# EAGLE schematic AES_HWR1_M2018 (EAGLE 8.6.1)
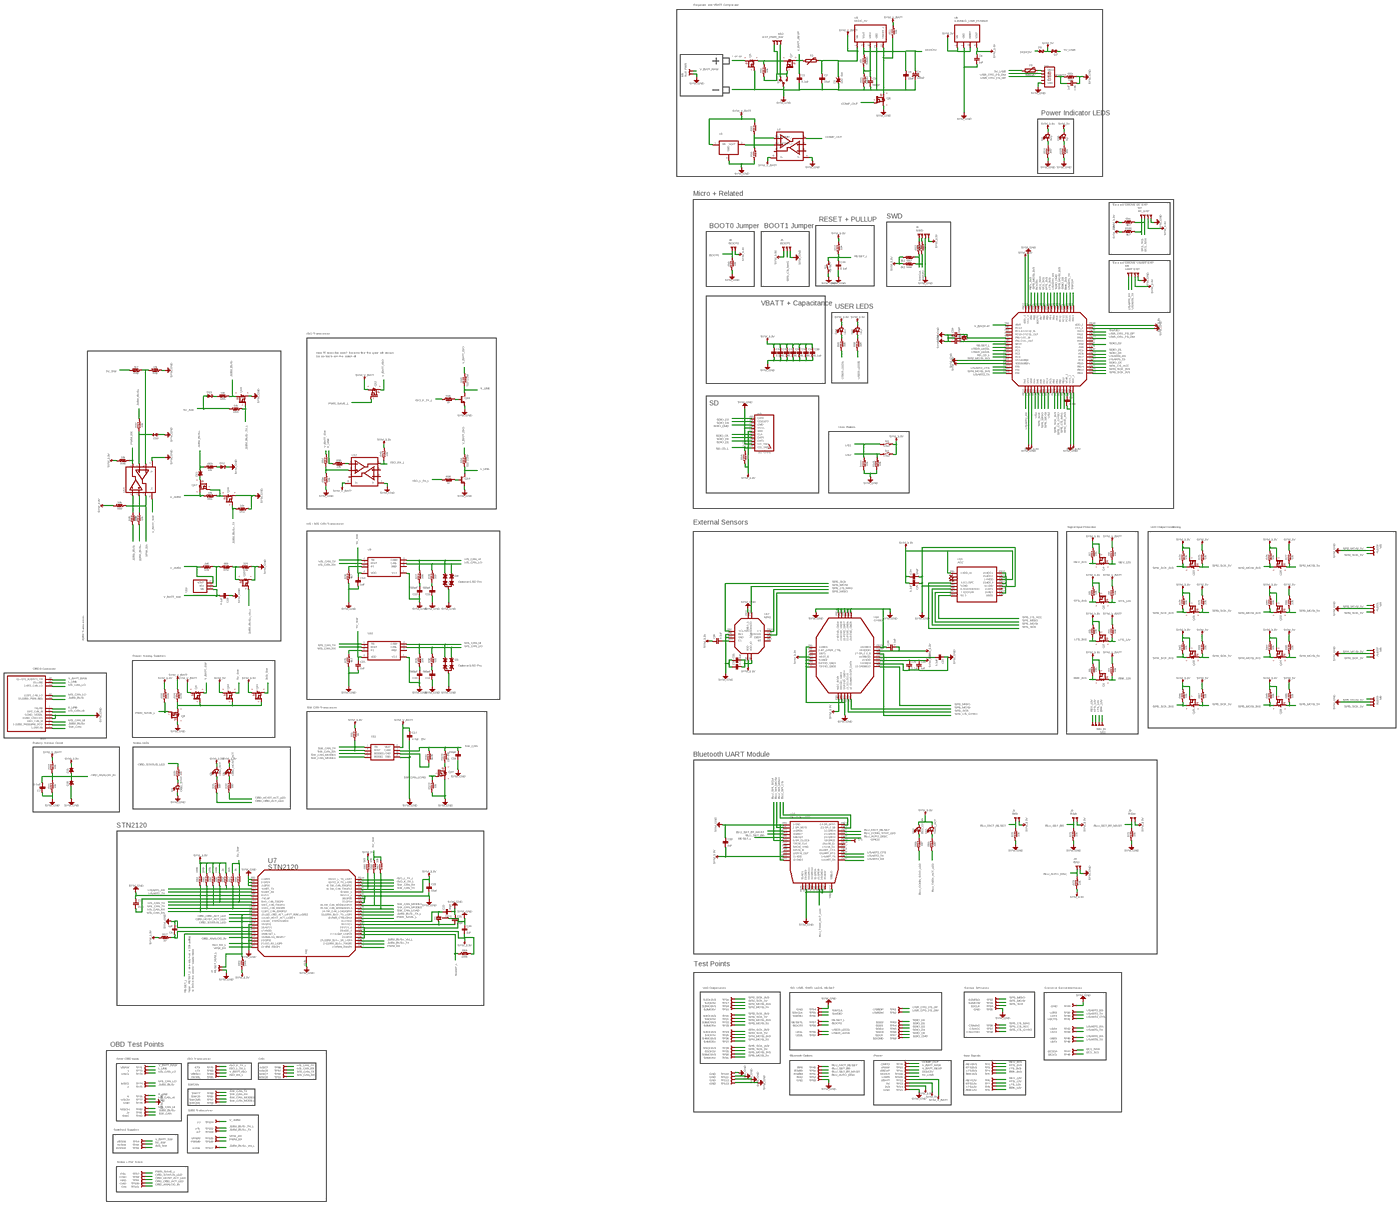
[diagram p0: schematic, sheet 1, overview]
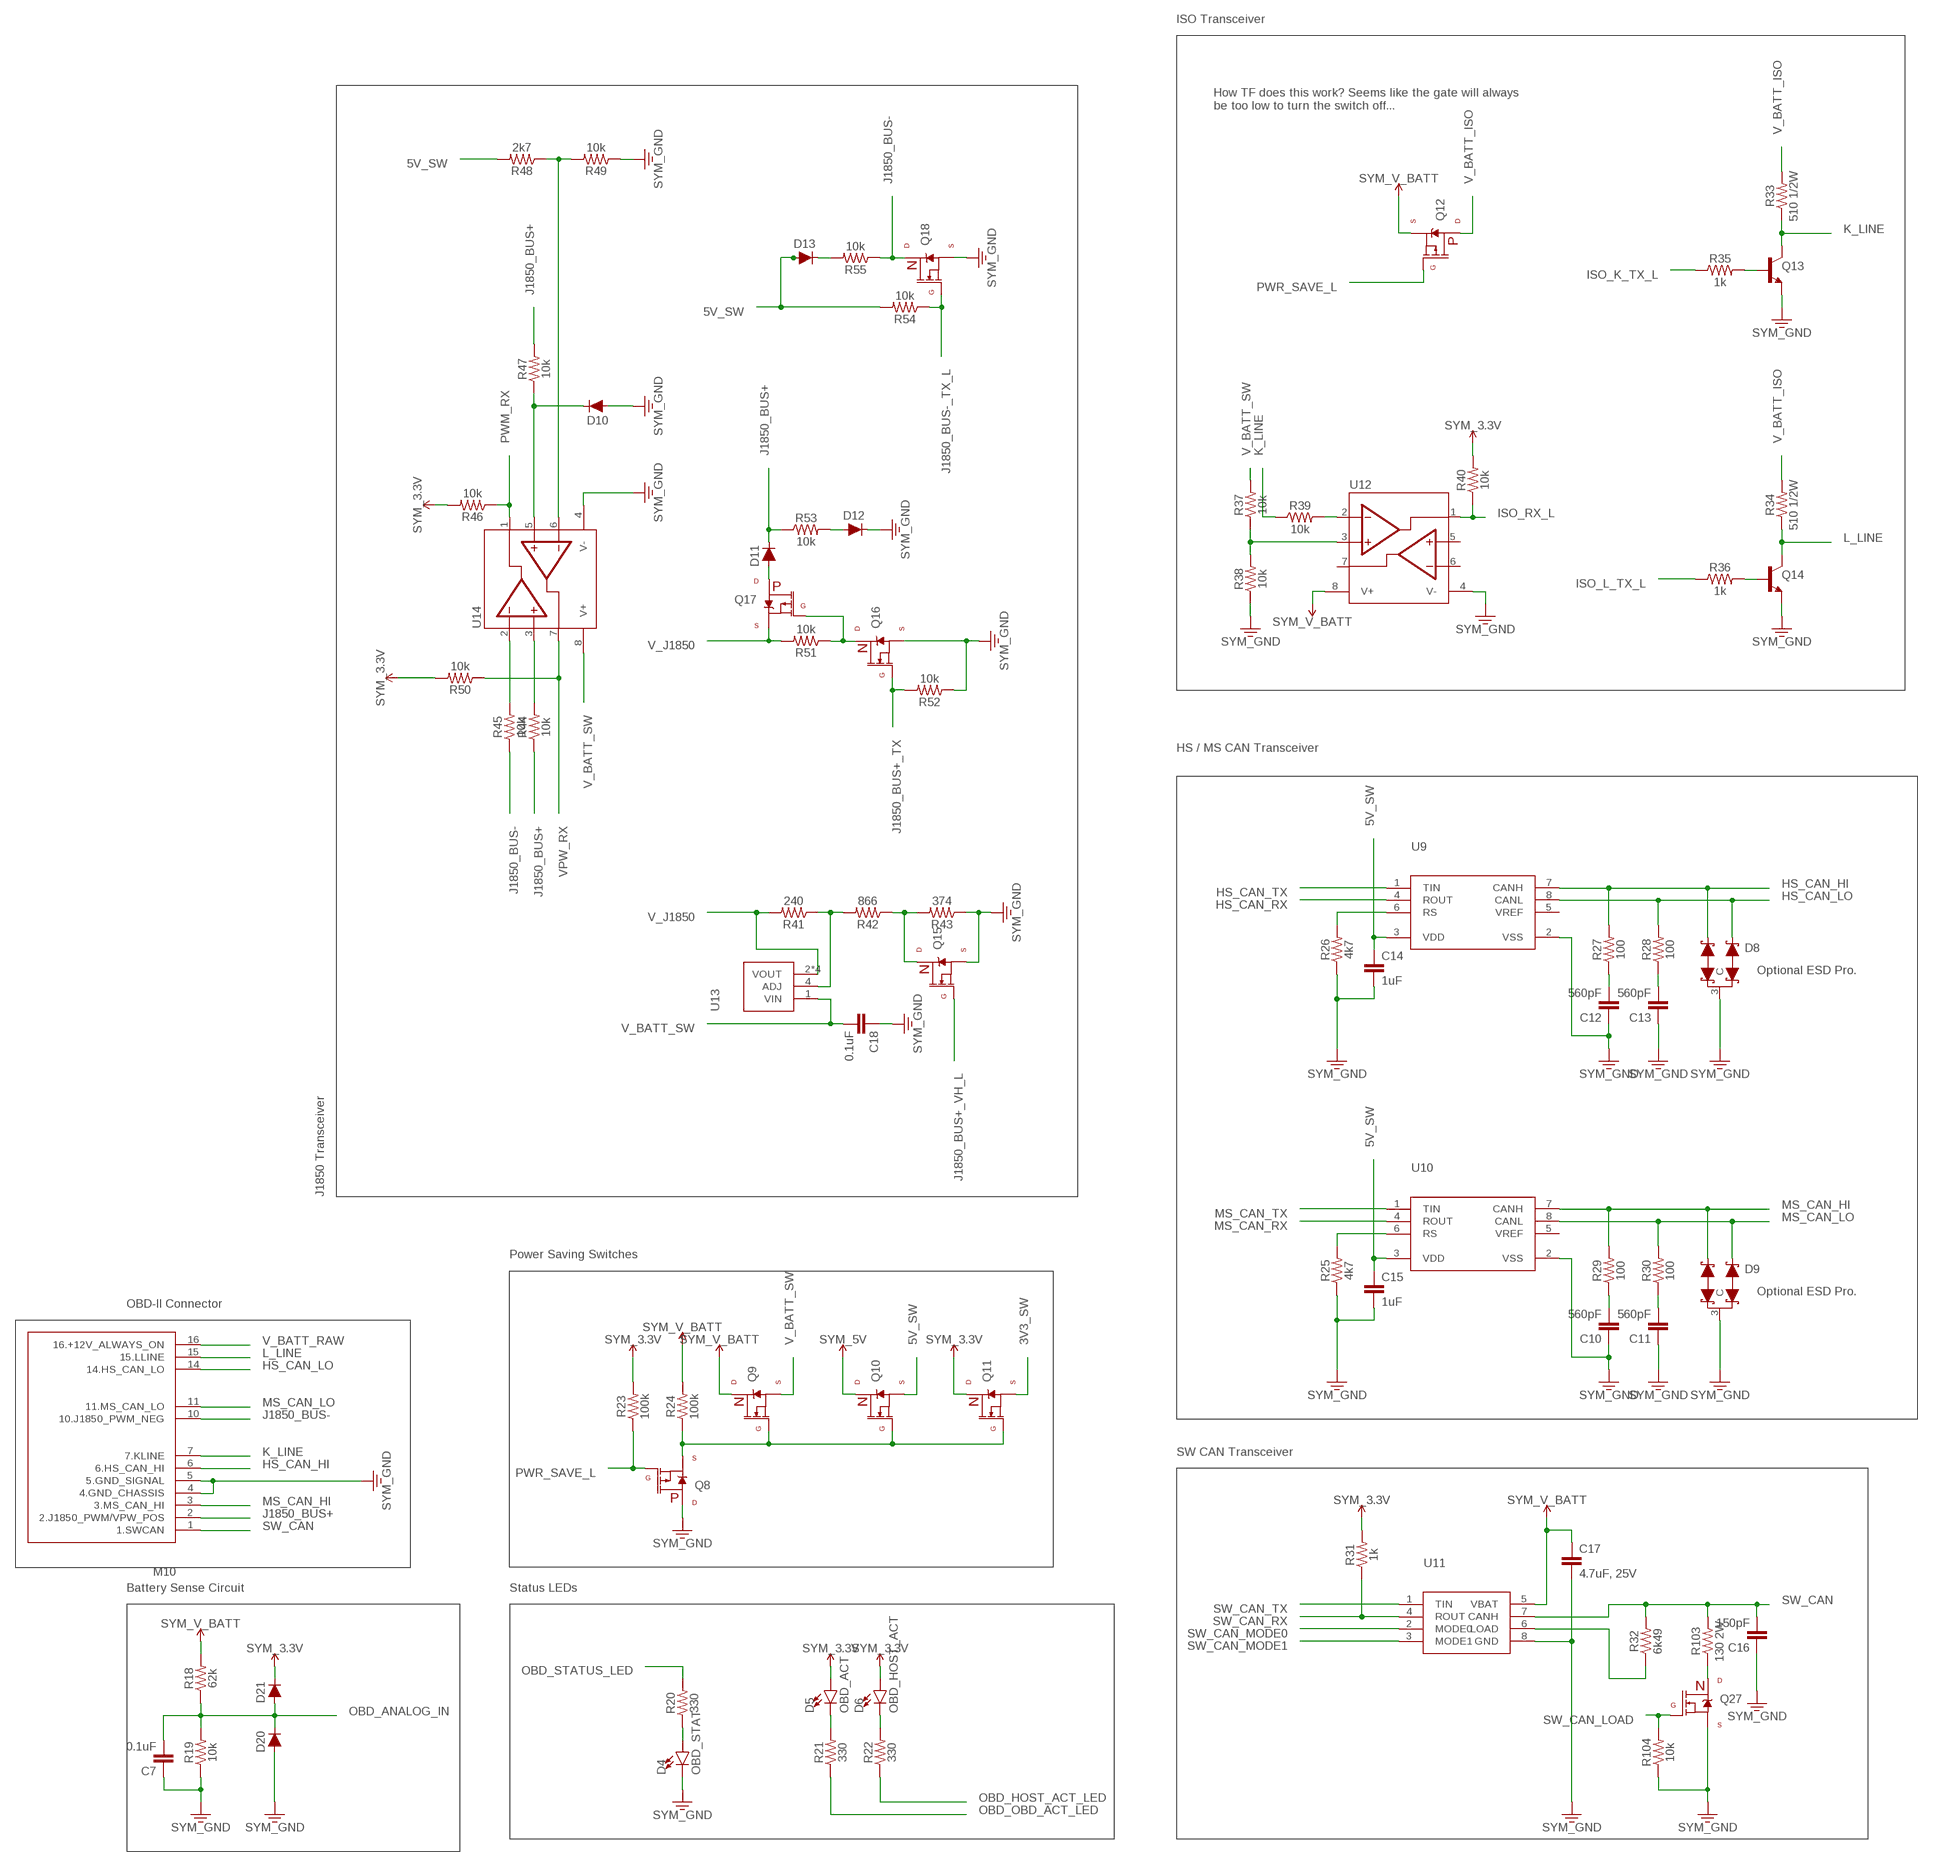
[diagram p1: schematic, sheet 1, part 1 of 5]
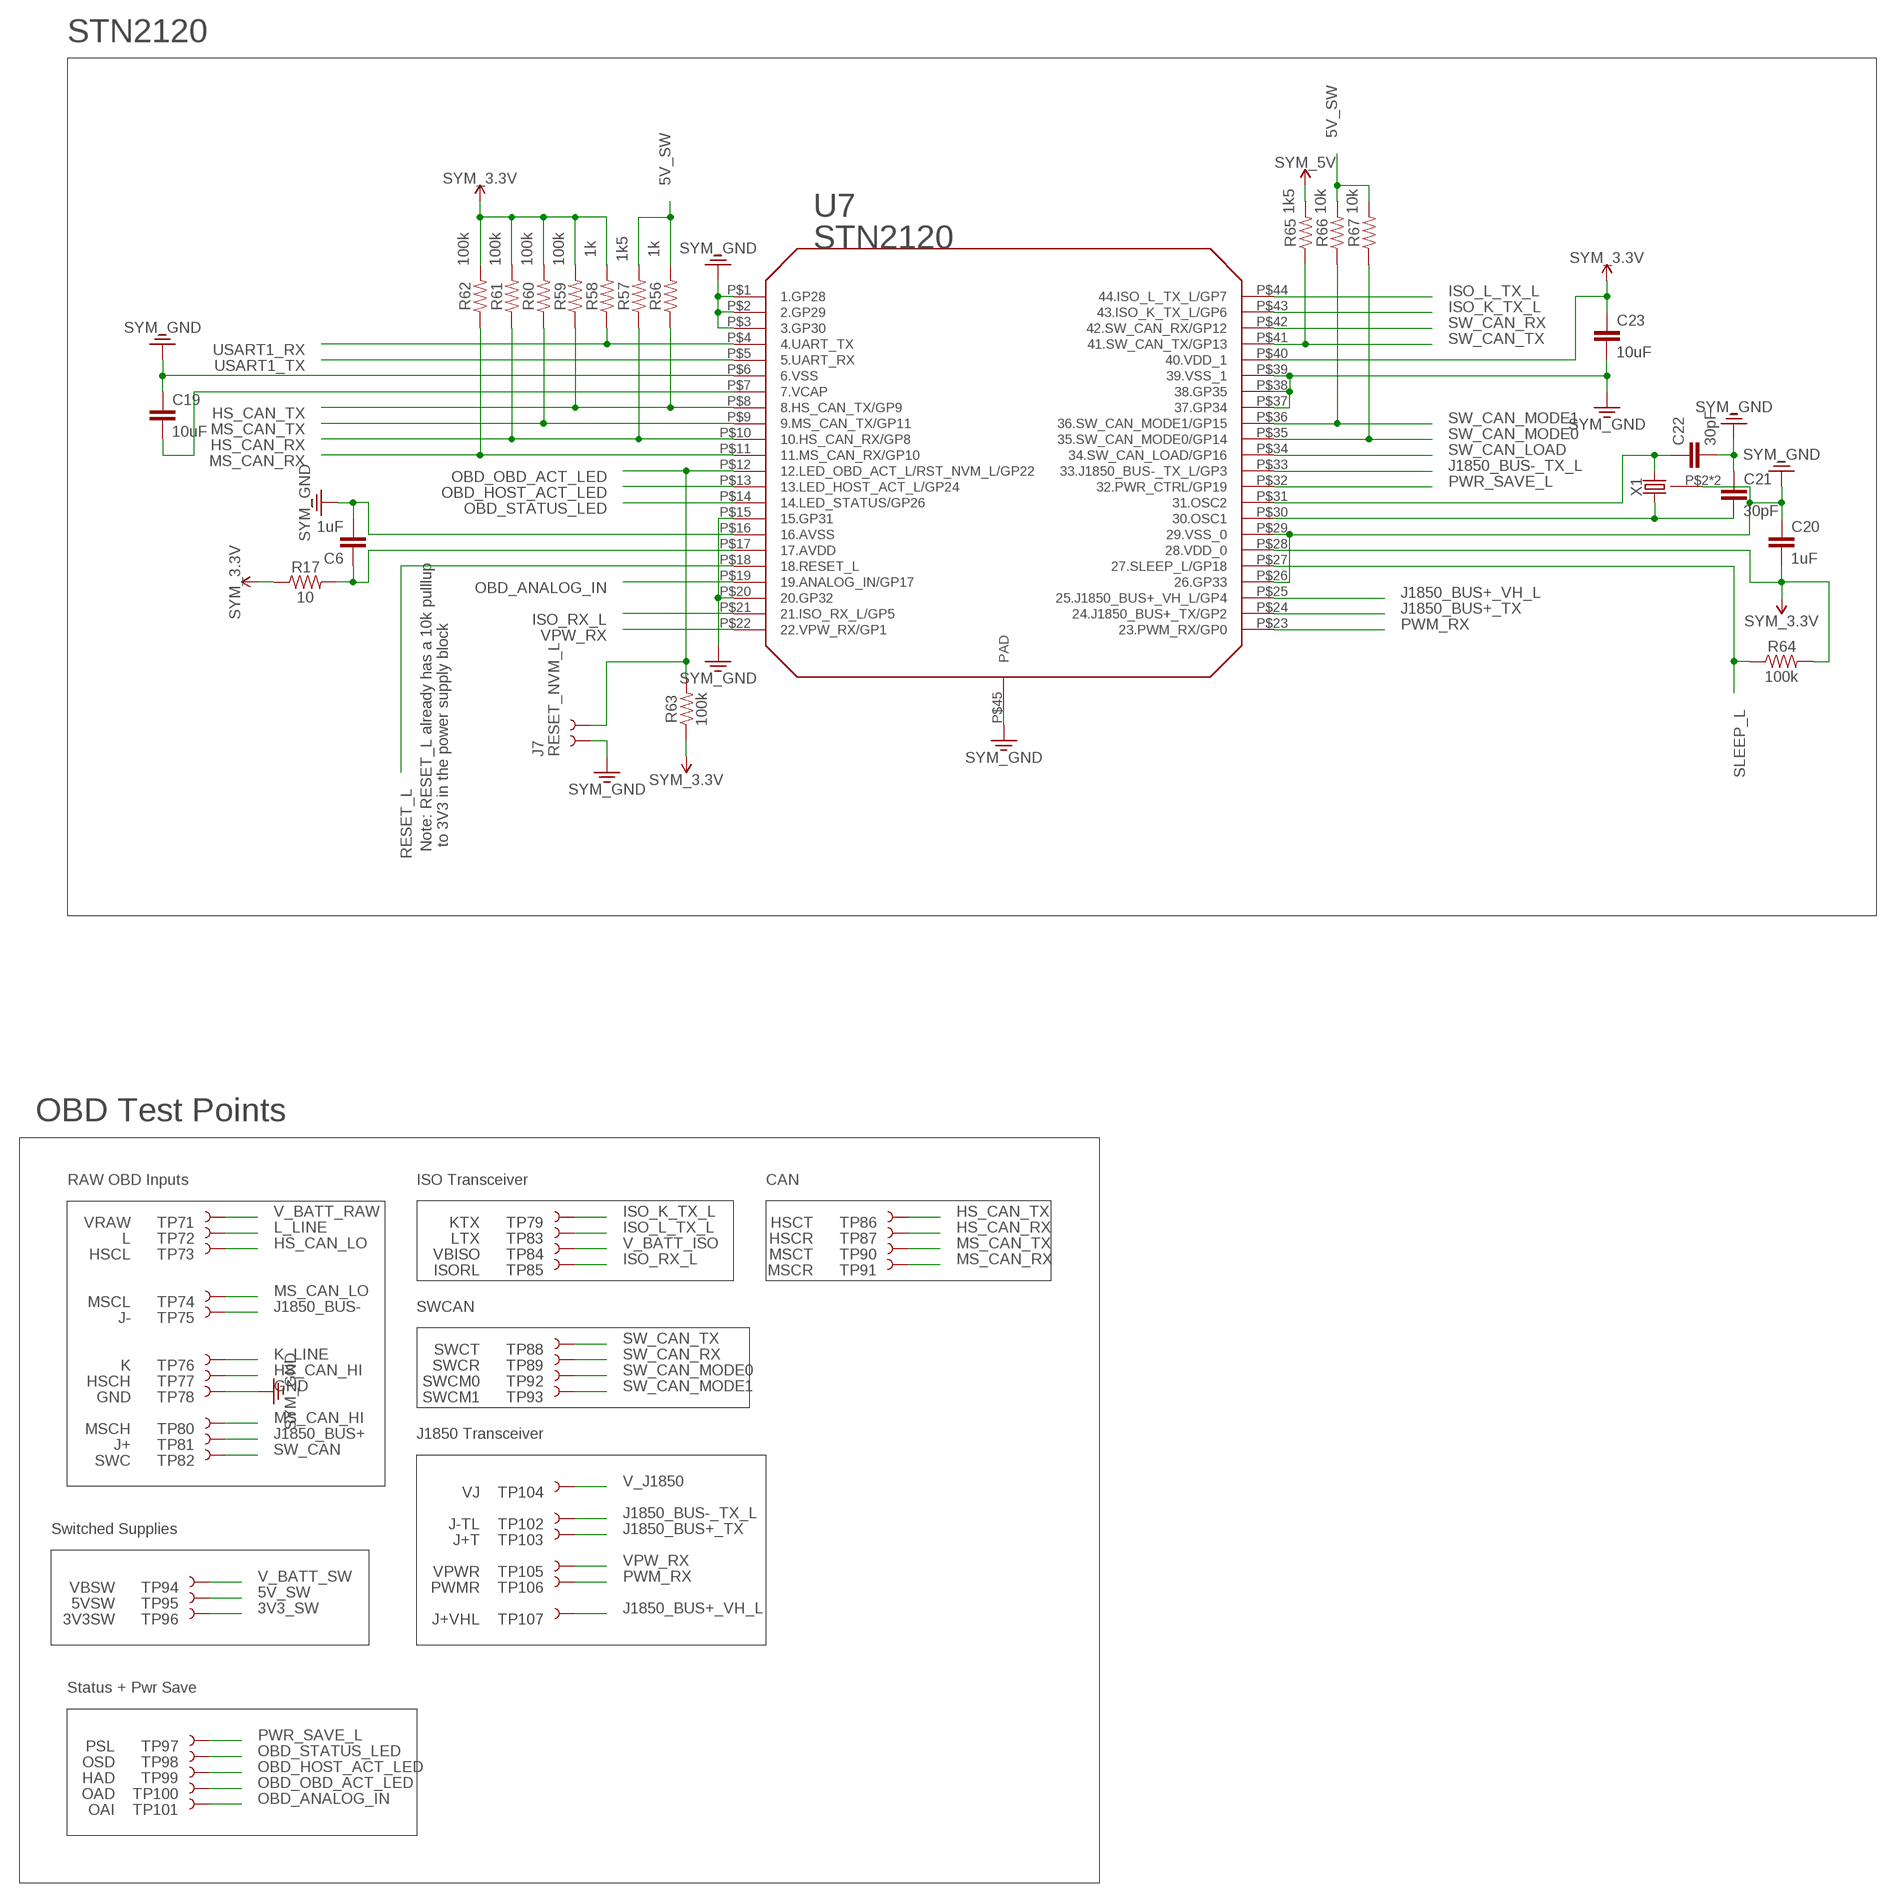
[diagram p2: schematic, sheet 1, part 2 of 5]
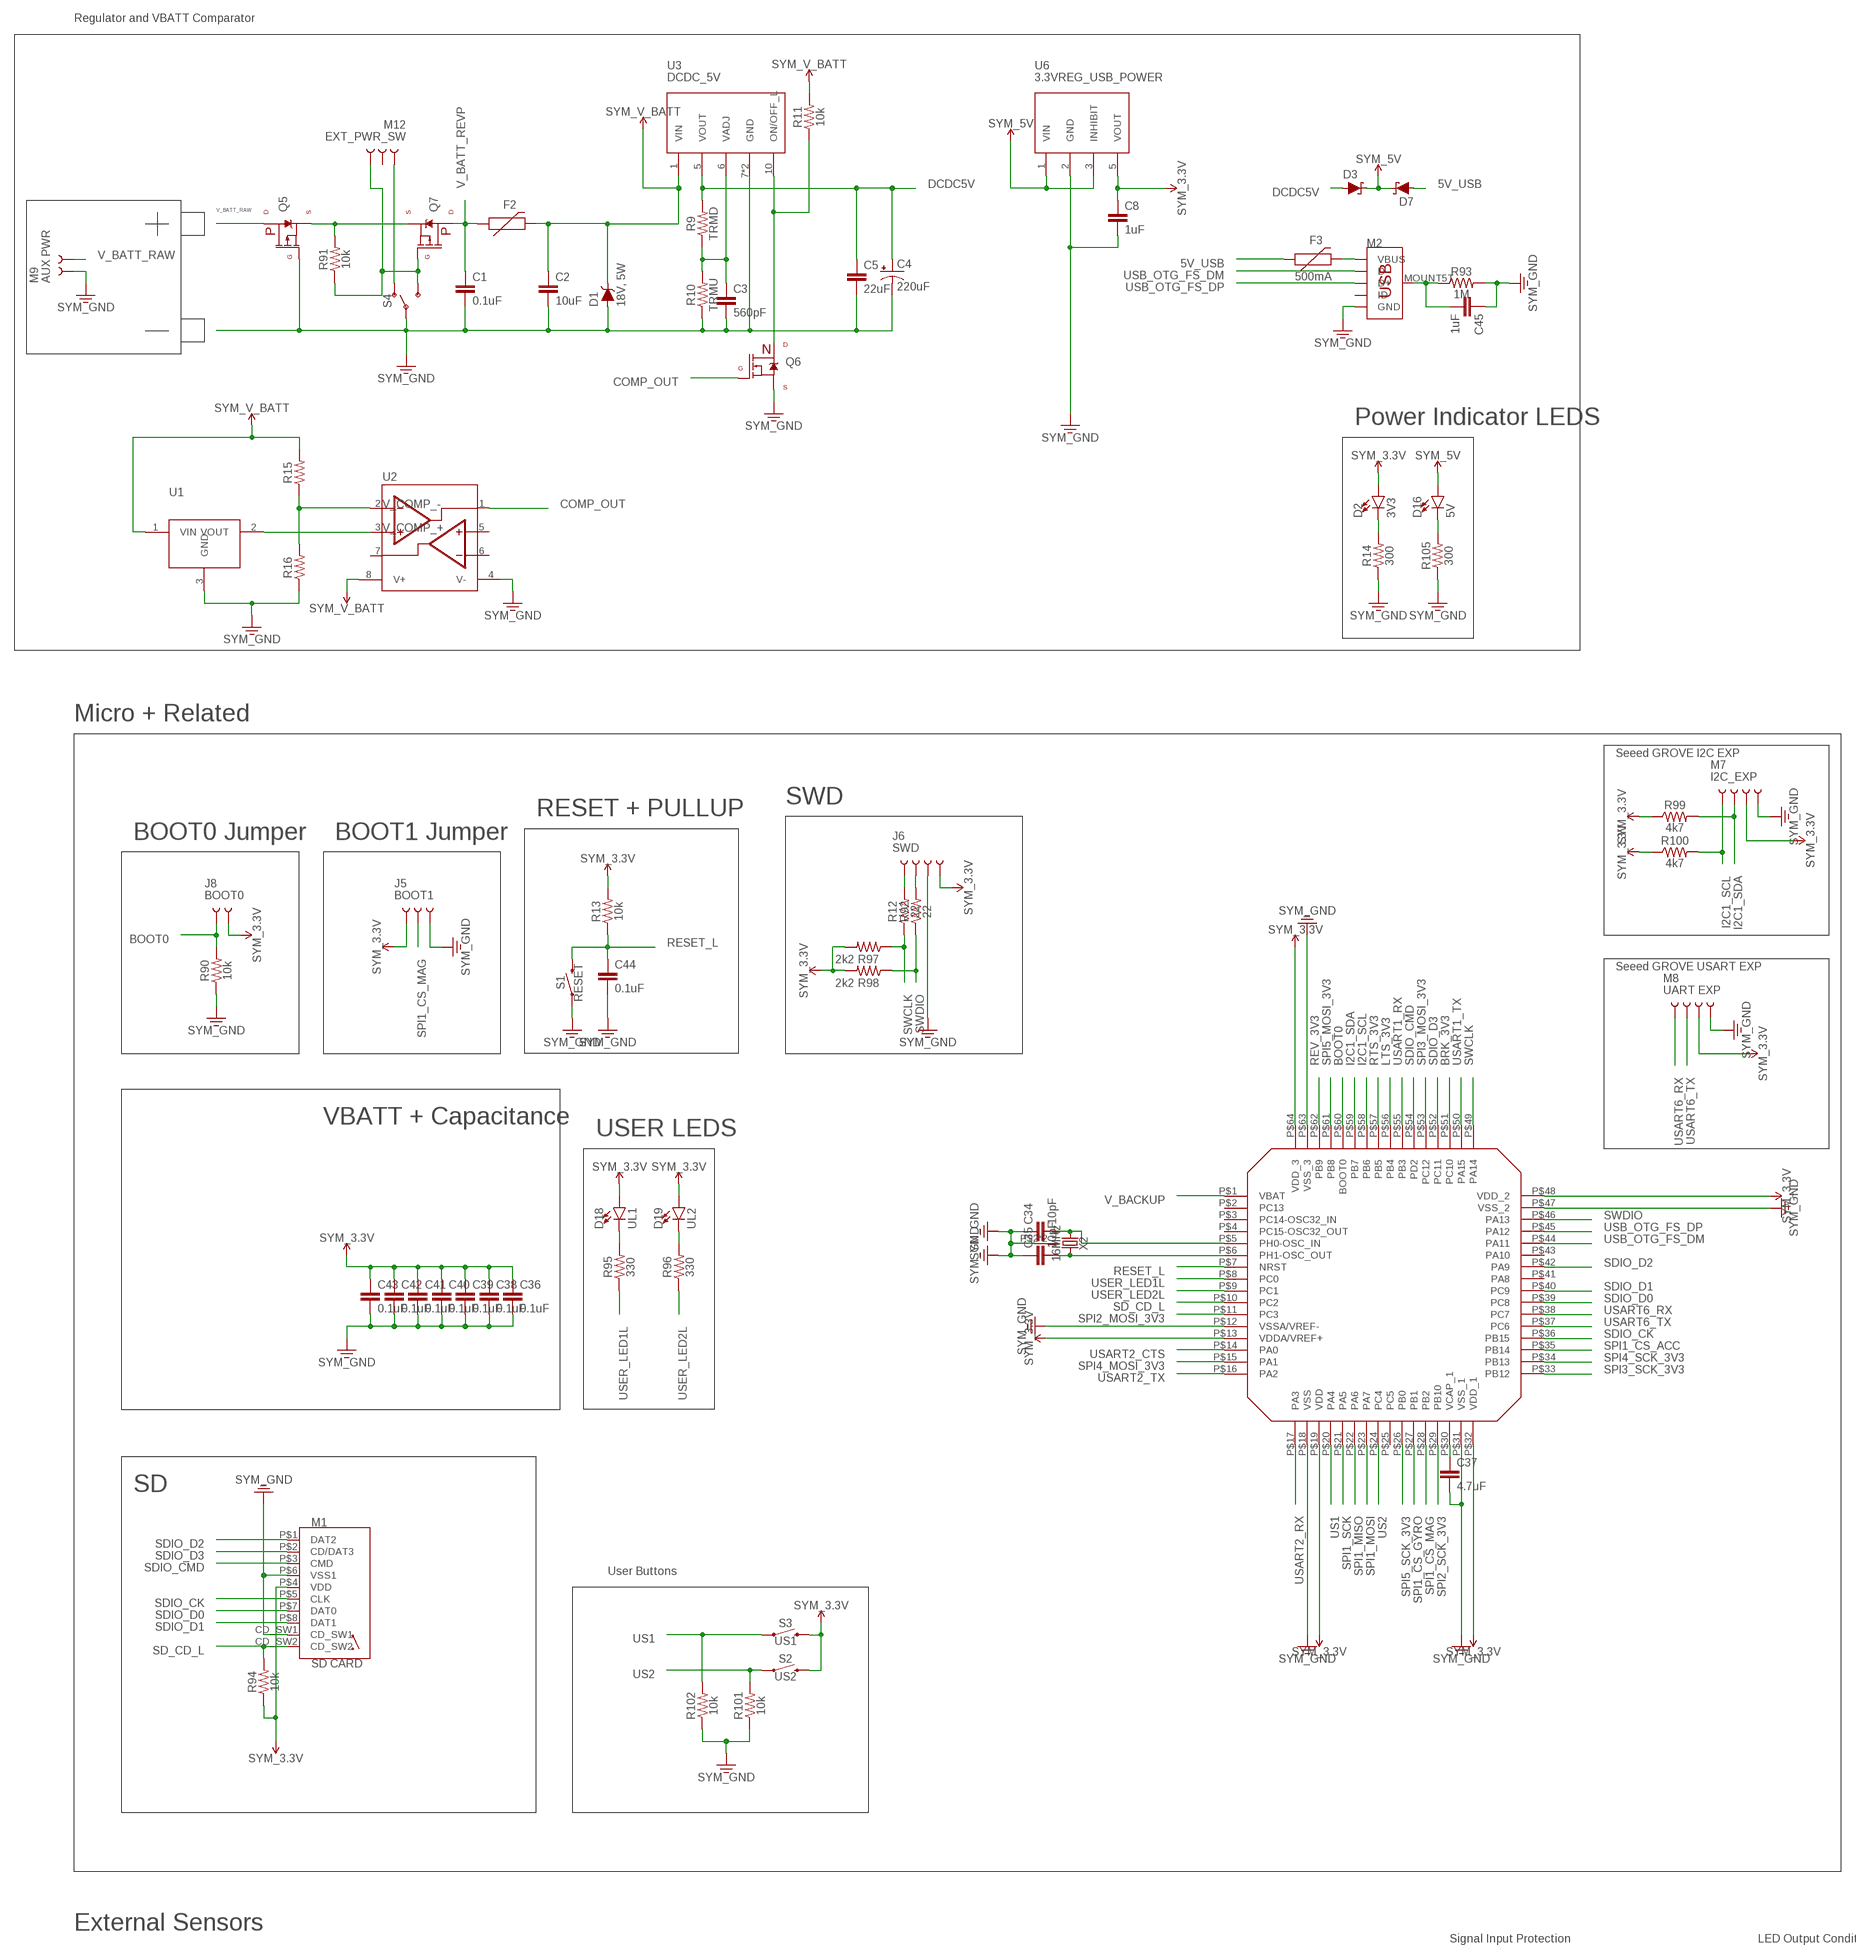
[diagram p3: schematic, sheet 1, part 3 of 5]
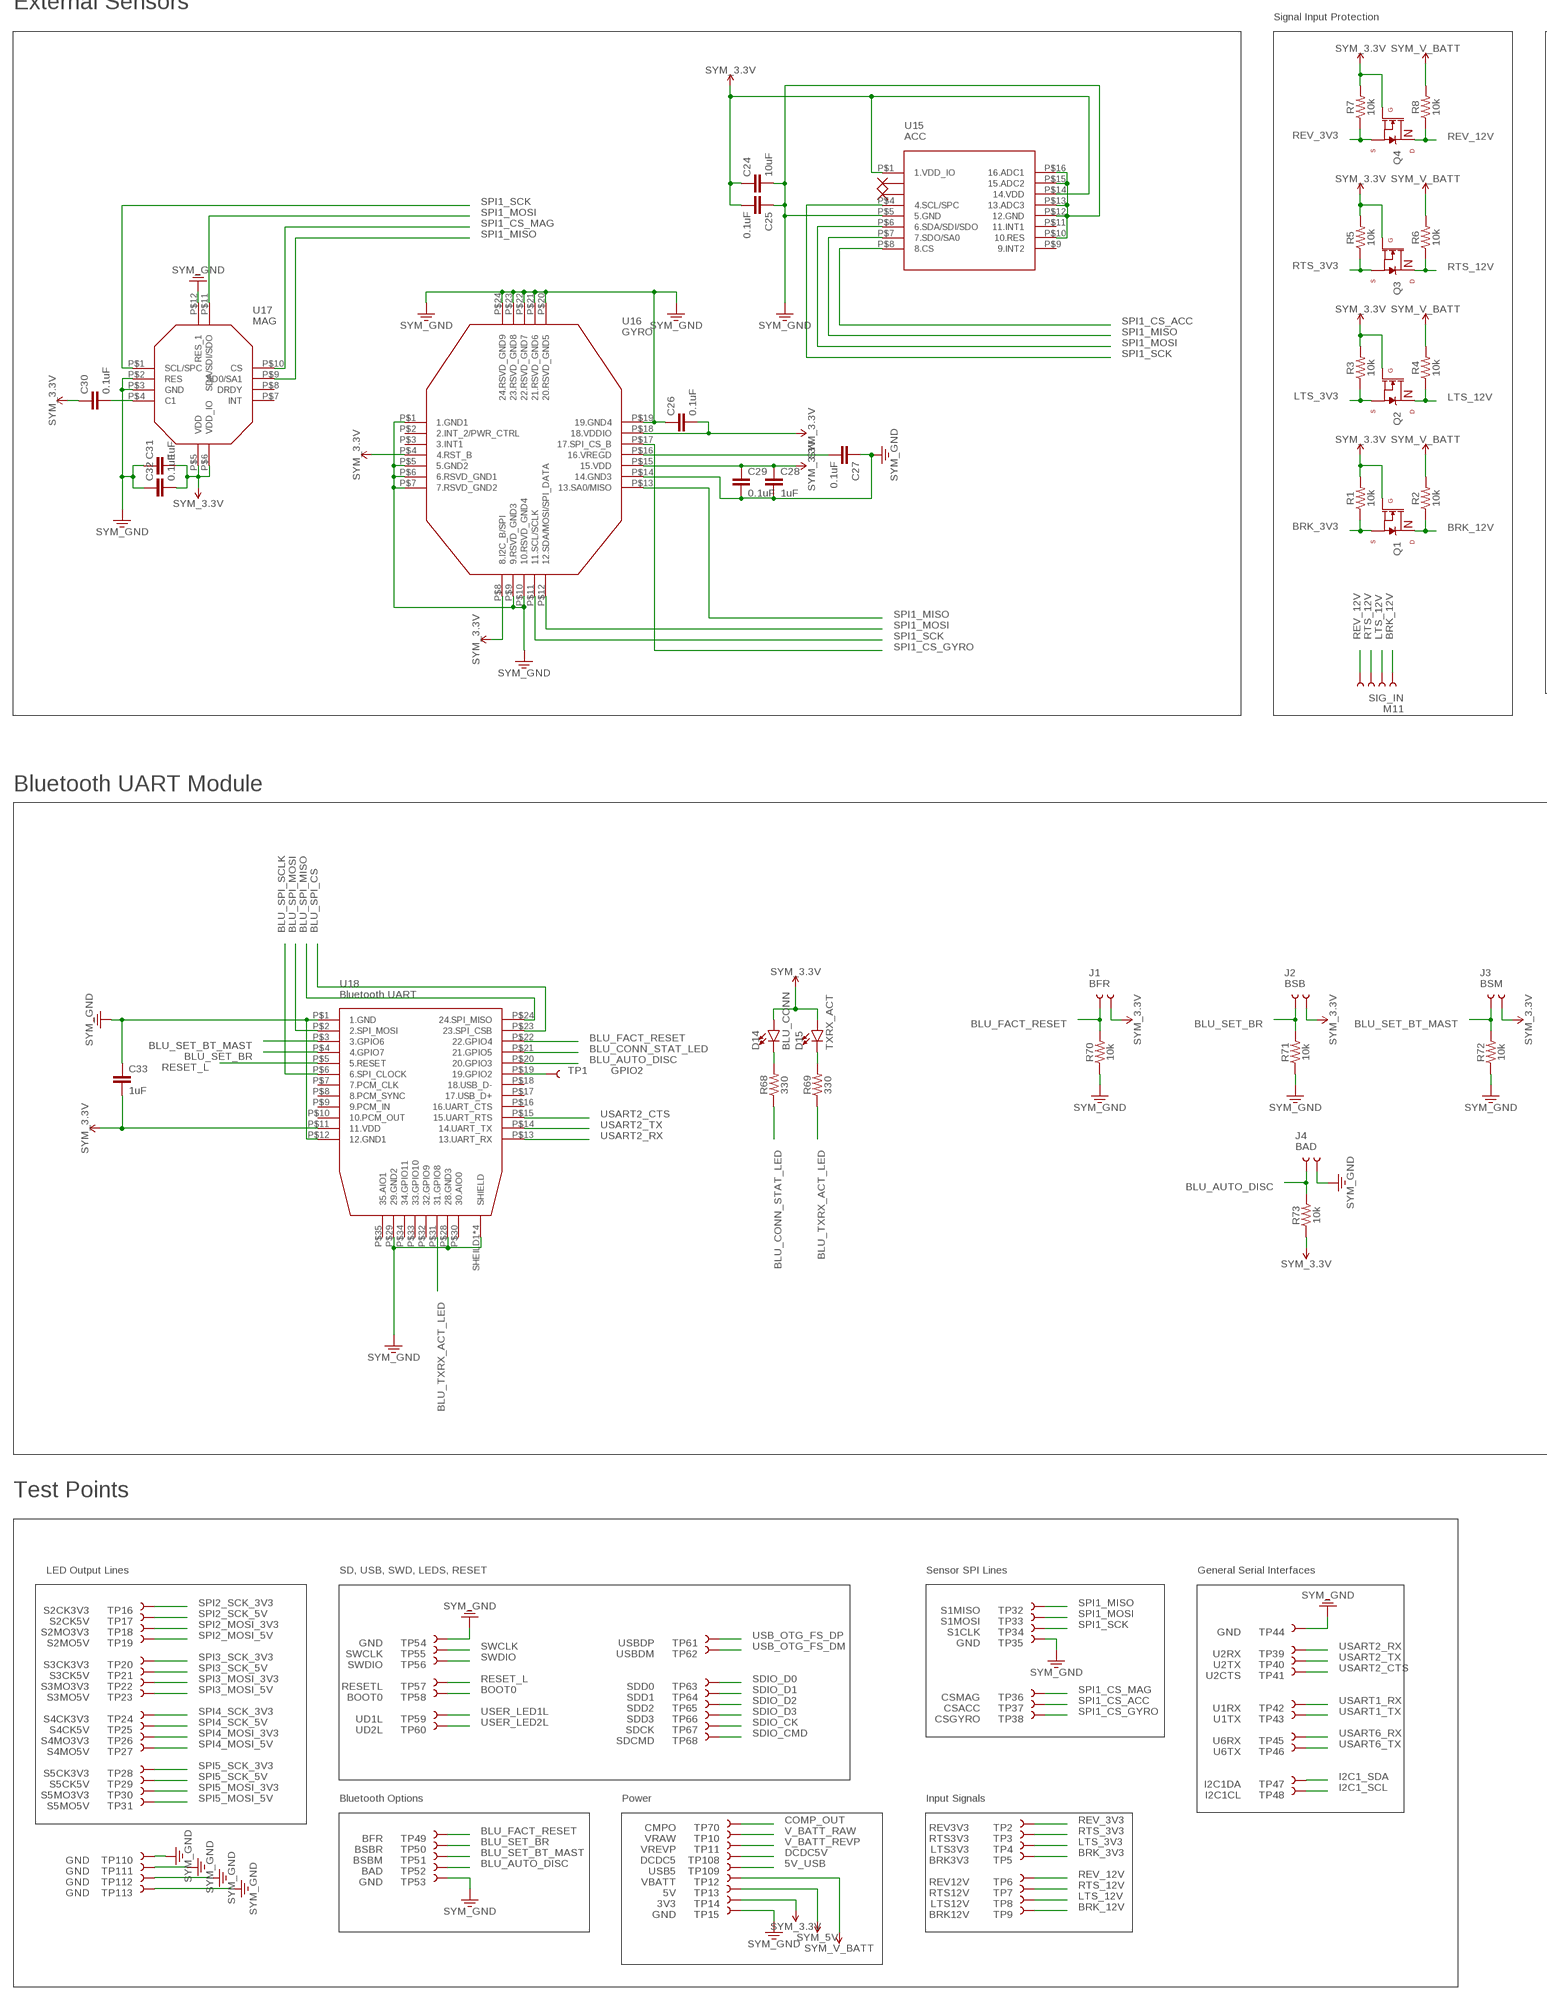
[diagram p4: schematic, sheet 1, part 4 of 5]
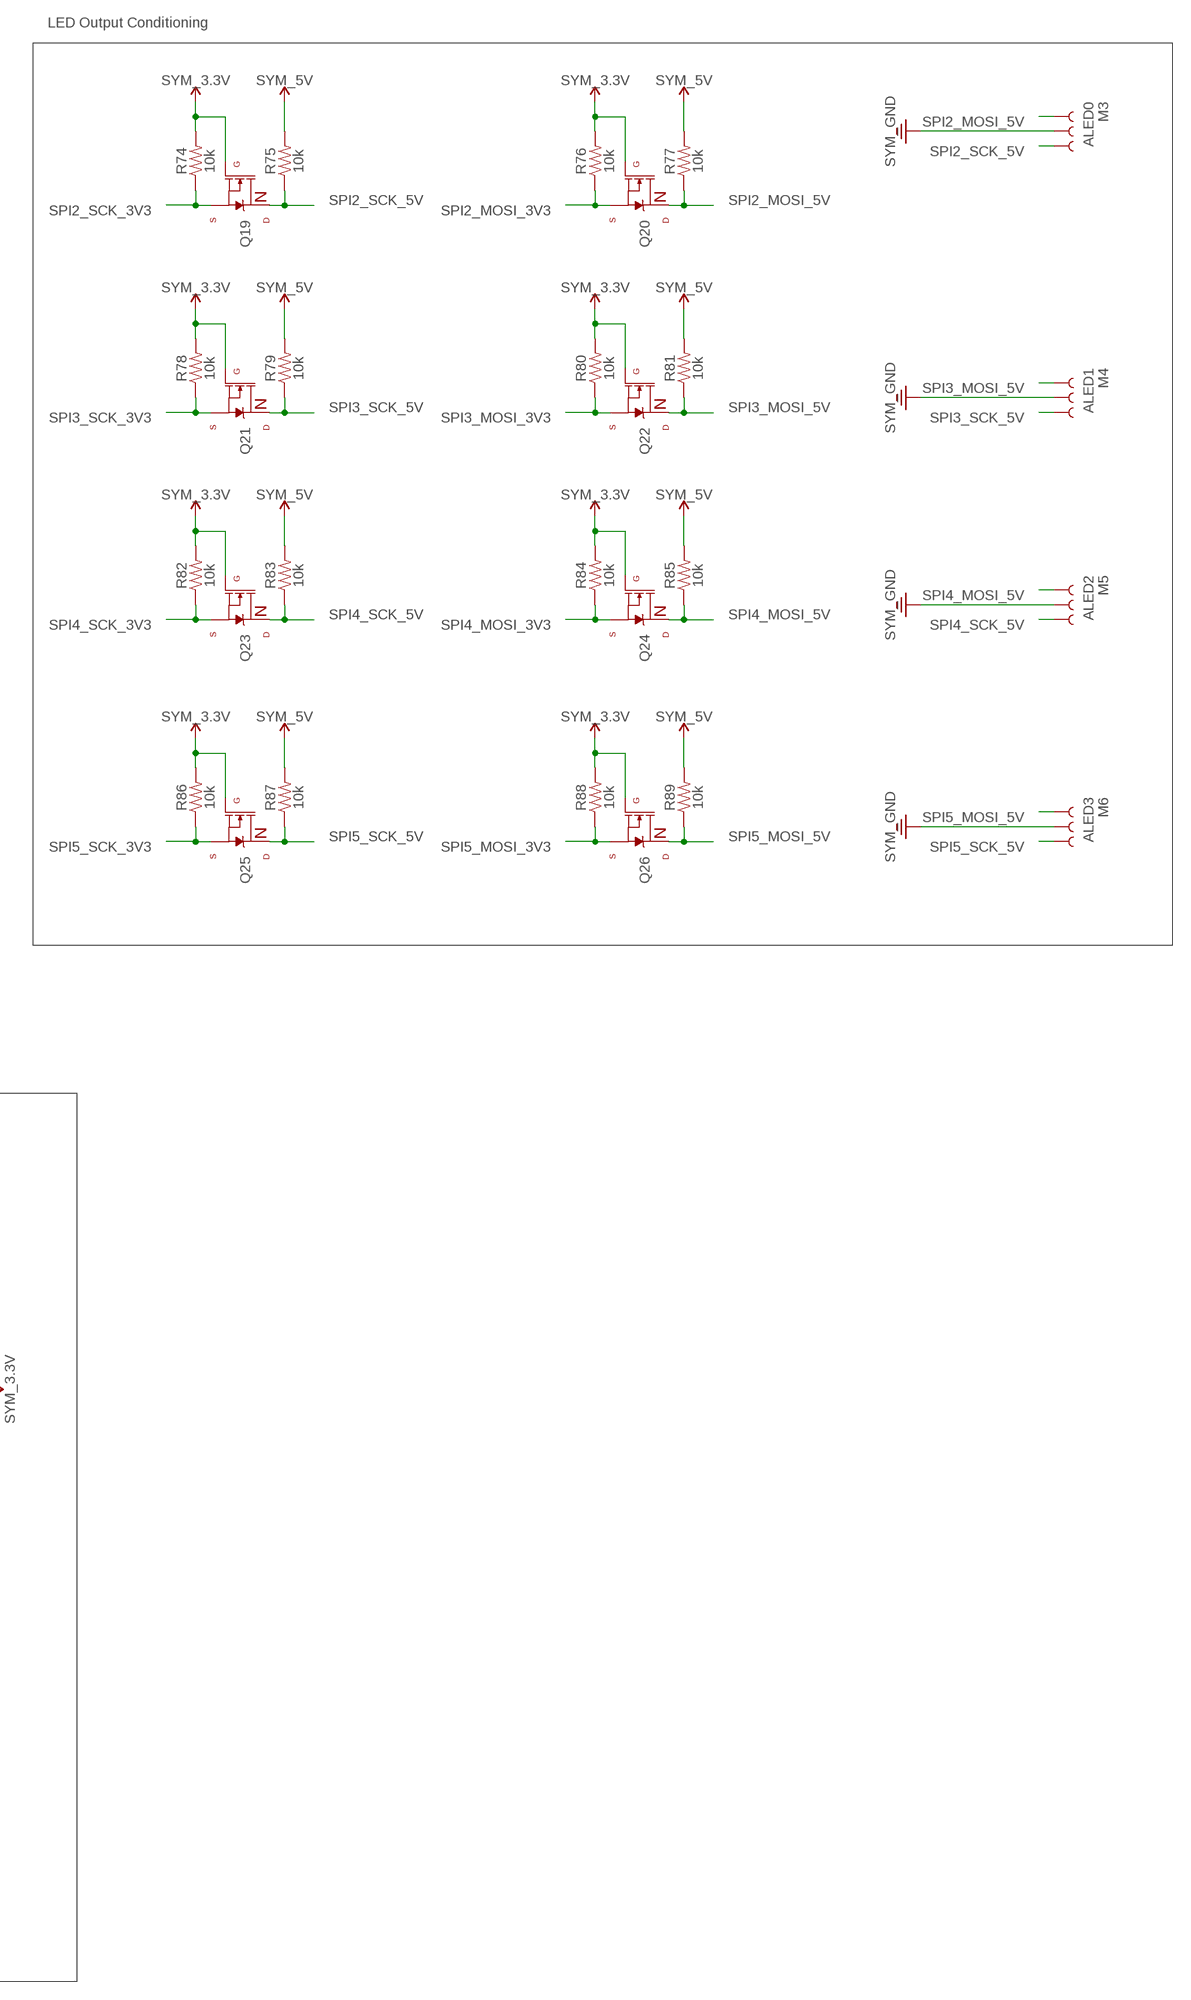
[diagram p5: schematic, sheet 1, part 5 of 5]

## Parts
C1  0.1uF  PASS_CAP_CER-SMD_0603  [0603]
C2  10uF  PASS_CAP_CER-SMD_1206  [1206]
C3  560pF  PASS_CAP_CER-SMD_0603  [0603]
C4  220uF  PASS_CAP_TANT  [2917_P]
C5  22uF  PASS_CAP_CER-SMD_1206  [1206]
C6  1uF  PASS_CAP_CER-SMD_0603  [0603]
C7  0.1uF  PASS_CAP_CER-SMD_0603  [0603]
C8  1uF  PASS_CAP_CER-SMD_0603  [0603]
C10  560pF  PASS_CAP_CER-SMD_0603  [0603]
C11  560pF  PASS_CAP_CER-SMD_0603  [0603]
C12  560pF  PASS_CAP_CER-SMD_0603  [0603]
C13  560pF  PASS_CAP_CER-SMD_0603  [0603]
C14  1uF  PASS_CAP_CER-SMD_0603  [0603]
C15  1uF  PASS_CAP_CER-SMD_0603  [0603]
C16  150pF  PASS_CAP_CER-SMD_0603  [0603]
C17  4.7uF, 25V  PASS_CAP_CER-SMD_0603  [0603]
C18  0.1uF  PASS_CAP_CER-SMD_0603  [0603]
C19  10uF  PASS_CAP_CER-SMD_1206  [1206]
C20  1uF  PASS_CAP_CER-SMD_0603  [0603]
C21  30pF  PASS_CAP_CER-SMD_0603  [0603]
C22  30pF  PASS_CAP_CER-SMD_0603  [0603]
C23  10uF  PASS_CAP_CER-SMD_0603  [0603]
C24  10uF  PASS_CAP_CER-SMD_0603  [0603]
C25  0.1uF  PASS_CAP_CER-SMD_0603  [0603]
C26  0.1uF  PASS_CAP_CER-SMD_0603  [0603]
C27  0.1uF  PASS_CAP_CER-SMD_0603  [0603]
C28  1uF  PASS_CAP_CER-SMD_0603  [0603]
C29  0.1uF  PASS_CAP_CER-SMD_0603  [0603]
C30  0.1uF  PASS_CAP_CER-SMD_0603  [0603]
C31  1uF  PASS_CAP_CER-SMD_0603  [0603]
C32  0.1uF  PASS_CAP_CER-SMD_0603  [0603]
C33  1uF  PASS_CAP_CER-SMD_0603  [0603]
C34  10pF  PASS_CAP_CER-SMD_0603  [0603]
C35  10pF  PASS_CAP_CER-SMD_0603  [0603]
C36  0.1uF  PASS_CAP_CER-SMD_0603  [0603]
C37  4.7uF  PASS_CAP_CER-SMD_0603  [0603]
C38  0.1uF  PASS_CAP_CER-SMD_0603  [0603]
C39  0.1uF  PASS_CAP_CER-SMD_0603  [0603]
C40  0.1uF  PASS_CAP_CER-SMD_0603  [0603]
C41  0.1uF  PASS_CAP_CER-SMD_0603  [0603]
C42  0.1uF  PASS_CAP_CER-SMD_0603  [0603]
C43  0.1uF  PASS_CAP_CER-SMD_0603  [0603]
C44  0.1uF  PASS_CAP_CER-SMD_0603  [0603]
C45  1uF  PASS_CAP_CER-SMD_0603  [0603]
D1  18V, 5W  PASS_DIODE_ZENER-SMBJ5355B  [DO-214AA]
D2  3V3  PASS_DIODE_LED-SMLE13BC8TT86  [0603-POLAR]
D3  PASS_DIODE_SCHOTTKY-LSM115J  [DO-214BA]
D4  OBD_STAT  PASS_DIODE_LED-SMLE13BC8TT86  [0603-POLAR]
D5  OBD_ACT  PASS_DIODE_LED-LTST-C190KFKT  [0603-POLAR]
D6  OBD_HOST_ACT  PASS_DIODE_LED-LTST-C190KFKT  [0603-POLAR]
D7  PASS_DIODE_SCHOTTKY-LSM115J  [DO-214BA]
D8  PASS_DIODE_ESD_CAN-PESD1CAN-UX  [SOT23-3]
D9  PASS_DIODE_ESD_CAN-PESD1CAN-UX  [SOT23-3]
D10  PASS_DIODE_GEN-1N4148X  [SOD-523]
D11  PASS_DIODE_GEN-1N4148X  [SOD-523]
D12  PASS_DIODE_GEN-1N4148X  [SOD-523]
D13  PASS_DIODE_GEN-1N4148X  [SOD-523]
D14  BLU_CONN  PASS_DIODE_LED-SMLE13BC8TT86  [0603-POLAR]
D15  TXRX_ACT  PASS_DIODE_LED-LTST-C190KFKT  [0603-POLAR]
D16  5V  PASS_DIODE_LED-SMLE13BC8TT86  [0603-POLAR]
D18  UL1  PASS_DIODE_LED-SMLE13BC8TT86  [0603-POLAR]
D19  UL2  PASS_DIODE_LED-SMLE13BC8TT86  [0603-POLAR]
D20  PASS_DIODE_GEN-1N4148X  [SOD-523]
D21  PASS_DIODE_GEN-1N4148X  [SOD-523]
F2  PASS_FUSE_POLY-1206L200SLYR  [1206]
F3  500mA  PASS_FUSE_POLY-0ZCJ0050FF2G  [1206]
J1  BFR  ZMISC_JUMPER_2PTH_0.1IN  [1X02]
J2  BSB  ZMISC_JUMPER_2PTH_0.1IN  [1X02]
J3  BSM  ZMISC_JUMPER_2PTH_0.1IN  [1X02]
J4  BAD  ZMISC_JUMPER_2PTH_0.1IN  [1X02]
J5  BOOT1  ZMISC_JUMPER_3PTH_0.1IN  [1X03]
J6  SWD  ZMISC_JUMPER_4PTH_0.1IN  [1X04]
J7  RESET_NVM_L  ZMISC_JUMPER_2SMD_0.1IN  [SMD_HEADER_0.1IN_2POS]
J8  BOOT0  ZMISC_JUMPER_2PTH_0.1IN  [1X02]
M1  SD CARD  SD_MICRO_SOCKET-114-00841-68  [SD_AMPHENOL_PUSH_PULL]
M2  USB_MICRO-MID_MOUNT_REVERSIBLE  [MICROUSB]
M3  ALED0  CONN_LED_OUT-MOLEX_5055670371  [3_PIN_LOCK]
M4  ALED1  CONN_LED_OUT-MOLEX_5055670371  [3_PIN_LOCK]
M5  ALED2  CONN_LED_OUT-MOLEX_5055670371  [3_PIN_LOCK]
M6  ALED3  CONN_LED_OUT-MOLEX_5055670371  [3_PIN_LOCK]
M7  I2C_EXP  CONN_LOCK_4-MOLEX_5055670471  [4_PIN_LOCK]
M8  UART EXP  CONN_LOCK_4-MOLEX_5055670471  [4_PIN_LOCK]
M9  AUX PWR  CONN_LOCK_2-5055670271  [2_PIN_LOCK]
M10  OBD_CONN-4-794627-6  [OBD_16_SMD]
M11  SIG_IN  CONN_LOCK_4-MOLEX_5055670471  [4_PIN_LOCK]
M12  EXT_PWR_SW  CONN_LED_OUT-MOLEX_5055670371  [3_PIN_LOCK]
Q1  PASS_NMOS-2N7002K  [SOT23-3@1]
Q2  PASS_NMOS-2N7002K  [SOT23-3@1]
Q3  PASS_NMOS-2N7002K  [SOT23-3@1]
Q4  PASS_NMOS-2N7002K  [SOT23-3@1]
Q5  AMP_MOSFET_PCH-MCQ4459  [SOP-8]
Q6  AMP_MOSFET_NCH-2N7002K  [SOT23-3]
Q7  AMP_MOSFET_PCH-MCQ4459  [SOP-8]
Q8  PASS_PMOS-MCQ4459  [SOP-8@1]
Q9  PASS_NMOS-2N7002K  [SOT23-3@1]
Q10  PASS_NMOS-2N7002K  [SOT23-3@1]
Q11  PASS_NMOS-2N7002K  [SOT23-3@1]
Q12  AMP_MOSFET_PCH-MCQ4459  [SOP-8]
Q13  AMP_BJT_NPNZXTN19100CFF  [SOT23-3]
Q14  AMP_BJT_NPNZXTN19100CFF  [SOT23-3]
Q15  AMP_MOSFET_NCH-2N7002K  [SOT23-3]
Q16  AMP_MOSFET_NCH-2N7002K  [SOT23-3]
Q17  AMP_MOSFET_PCH-MCQ4459  [SOP-8]
Q18  AMP_MOSFET_NCH-2N7002K  [SOT23-3]
Q19  AMP_MOSFET_NCH-2N7002K  [SOT23-3]
Q20  AMP_MOSFET_NCH-2N7002K  [SOT23-3]
Q21  AMP_MOSFET_NCH-2N7002K  [SOT23-3]
Q22  AMP_MOSFET_NCH-2N7002K  [SOT23-3]
Q23  AMP_MOSFET_NCH-2N7002K  [SOT23-3]
Q24  AMP_MOSFET_NCH-2N7002K  [SOT23-3]
Q25  AMP_MOSFET_NCH-2N7002K  [SOT23-3]
Q26  AMP_MOSFET_NCH-2N7002K  [SOT23-3]
Q27  AMP_MOSFET_NCH-2N7002K  [SOT23-3]
R1  10k  PASS_RES-SMD_0603  [0603]
R2  10k  PASS_RES-SMD_0603  [0603]
R3  10k  PASS_RES-SMD_0603  [0603]
R4  10k  PASS_RES-SMD_0603  [0603]
R5  10k  PASS_RES-SMD_0603  [0603]
R6  10k  PASS_RES-SMD_0603  [0603]
R7  10k  PASS_RES-SMD_0603  [0603]
R8  10k  PASS_RES-SMD_0603  [0603]
R9  TRMD  PASS_RES-SMD_0603  [0603]
R10  TRMU  PASS_RES-SMD_0603  [0603]
R11  10k  PASS_RES-SMD_0603  [0603]
R12  22  PASS_RES-SMD_0603  [0603]
R13  10k  PASS_RES-SMD_0603  [0603]
R14  300  PASS_RES-SMD_0603  [0603]
R15  PASS_RES-SMD_0603  [0603]
R16  PASS_RES-SMD_0603  [0603]
R17  10  PASS_RES-SMD_0603  [0603]
R18  62k  PASS_RES-SMD_0603  [0603]
R19  10k  PASS_RES-SMD_0603  [0603]
R20  330  PASS_RES-SMD_0603  [0603]
R21  330  PASS_RES-SMD_0603  [0603]
R22  330  PASS_RES-SMD_0603  [0603]
R23  100k  PASS_RES-SMD_0603  [0603]
R24  100k  PASS_RES-SMD_0603  [0603]
R25  4k7  PASS_RES-SMD_0603  [0603]
R26  4k7  PASS_RES-SMD_0603  [0603]
R27  100  PASS_RES-SMD_0603  [0603]
R28  100  PASS_RES-SMD_0603  [0603]
R29  100  PASS_RES-SMD_0603  [0603]
R30  100  PASS_RES-SMD_0603  [0603]
R31  1k  PASS_RES-SMD_0603  [0603]
R32  6k49  PASS_RES-SMD_0603  [0603]
R33  510 1/2W  PASS_RES-SMD_1206  [1206]
R34  510 1/2W  PASS_RES-SMD_1206  [1206]
R35  1k  PASS_RES-SMD_0603  [0603]
R36  1k  PASS_RES-SMD_0603  [0603]
R37  10k  PASS_RES-SMD_0603  [0603]
R38  10k  PASS_RES-SMD_0603  [0603]
R39  10k  PASS_RES-SMD_0603  [0603]
R40  10k  PASS_RES-SMD_0603  [0603]
R41  240  PASS_RES-SMD_0603  [0603]
R42  866  PASS_RES-SMD_0603  [0603]
R43  374  PASS_RES-SMD_0603  [0603]
R44  10k  PASS_RES-SMD_0603  [0603]
R45  10k  PASS_RES-SMD_0603  [0603]
R46  10k  PASS_RES-SMD_0603  [0603]
R47  10k  PASS_RES-SMD_0603  [0603]
R48  2k7  PASS_RES-SMD_0603  [0603]
R49  10k  PASS_RES-SMD_0603  [0603]
R50  10k  PASS_RES-SMD_0603  [0603]
R51  10k  PASS_RES-SMD_0603  [0603]
R52  10k  PASS_RES-SMD_0603  [0603]
R53  10k  PASS_RES-SMD_0603  [0603]
R54  10k  PASS_RES-SMD_0603  [0603]
R55  10k  PASS_RES-SMD_0603  [0603]
R56  1k  PASS_RES-SMD_0603  [0603]
R57  1k5  PASS_RES-SMD_0603  [0603]
R58  1k  PASS_RES-SMD_0603  [0603]
R59  100k  PASS_RES-SMD_0603  [0603]
R60  100k  PASS_RES-SMD_0603  [0603]
R61  100k  PASS_RES-SMD_0603  [0603]
R62  100k  PASS_RES-SMD_0603  [0603]
R63  100k  PASS_RES-SMD_0603  [0603]
R64  100k  PASS_RES-SMD_0603  [0603]
R65  1k5  PASS_RES-SMD_0603  [0603]
R66  10k  PASS_RES-SMD_0603  [0603]
R67  10k  PASS_RES-SMD_0603  [0603]
R68  330  PASS_RES-SMD_0603  [0603]
R69  330  PASS_RES-SMD_0603  [0603]
R70  10k  PASS_RES-SMD_0603  [0603]
R71  10k  PASS_RES-SMD_0603  [0603]
R72  10k  PASS_RES-SMD_0603  [0603]
R73  10k  PASS_RES-SMD_0603  [0603]
R74  10k  PASS_RES-SMD_0603  [0603]
R75  10k  PASS_RES-SMD_0603  [0603]
R76  10k  PASS_RES-SMD_0603  [0603]
R77  10k  PASS_RES-SMD_0603  [0603]
R78  10k  PASS_RES-SMD_0603  [0603]
R79  10k  PASS_RES-SMD_0603  [0603]
R80  10k  PASS_RES-SMD_0603  [0603]
R81  10k  PASS_RES-SMD_0603  [0603]
R82  10k  PASS_RES-SMD_0603  [0603]
R83  10k  PASS_RES-SMD_0603  [0603]
R84  10k  PASS_RES-SMD_0603  [0603]
R85  10k  PASS_RES-SMD_0603  [0603]
R86  10k  PASS_RES-SMD_0603  [0603]
R87  10k  PASS_RES-SMD_0603  [0603]
R88  10k  PASS_RES-SMD_0603  [0603]
R89  10k  PASS_RES-SMD_0603  [0603]
R90  10k  PASS_RES-SMD_0603  [0603]
R91  10k  PASS_RES-SMD_0603  [0603]
R92  22  PASS_RES-SMD_0603  [0603]
R93  1M  PASS_RES-SMD_0603  [0603]
R94  10k  PASS_RES-SMD_0603  [0603]
R95  330  PASS_RES-SMD_0603  [0603]
R96  330  PASS_RES-SMD_0603  [0603]
R97  2k2  PASS_RES-SMD_0603  [0603]
R98  2k2  PASS_RES-SMD_0603  [0603]
R99  4k7  PASS_RES-SMD_0603  [0603]
R100  4k7  PASS_RES-SMD_0603  [0603]
R101  10k  PASS_RES-SMD_0603  [0603]
R102  10k  PASS_RES-SMD_0603  [0603]
R103  130 2W  PASS_RES-SMD_2512  [2512]
R104  10k  PASS_RES-SMD_0603  [0603]
R105  300  PASS_RES-SMD_0603  [0603]
S1  RESET  BUTTON_TEMP_ON  [PTS525]
S2  US2  BUTTON_TEMP_ON  [PTS525]
S3  US1  BUTTON_TEMP_ON  [PTS525]
S4  SWITCH_SPDT_SLIDE_SPARKFUN_SMD  [SPARKFUNSWITCH]
TP1  GPIO2  TEST-POINT3X5  [PAD.03X.05]
TP2  REV3V3  TEST-POINT3X5  [PAD.03X.05]
TP3  RTS3V3  TEST-POINT3X5  [PAD.03X.05]
TP4  LTS3V3  TEST-POINT3X5  [PAD.03X.05]
TP5  BRK3V3  TEST-POINT3X5  [PAD.03X.05]
TP6  REV12V  TEST-POINT3X5  [PAD.03X.05]
TP7  RTS12V  TEST-POINT3X5  [PAD.03X.05]
TP8  LTS12V  TEST-POINT3X5  [PAD.03X.05]
TP9  BRK12V  TEST-POINT3X5  [PAD.03X.05]
TP10  VRAW  TEST-POINT3X5  [PAD.03X.05]
TP11  VREVP  TEST-POINT3X5  [PAD.03X.05]
TP12  VBATT  TEST-POINT3X5  [PAD.03X.05]
TP13  5V  TEST-POINT3X5  [PAD.03X.05]
TP14  3V3  TEST-POINT3X5  [PAD.03X.05]
TP15  GND  TEST-POINT3X5  [PAD.03X.05]
TP16  S2CK3V3  TEST-POINT3X5  [PAD.03X.05]
TP17  S2CK5V  TEST-POINT3X5  [PAD.03X.05]
TP18  S2MO3V3  TEST-POINT3X5  [PAD.03X.05]
TP19  S2MO5V  TEST-POINT3X5  [PAD.03X.05]
TP20  S3CK3V3  TEST-POINT3X5  [PAD.03X.05]
TP21  S3CK5V  TEST-POINT3X5  [PAD.03X.05]
TP22  S3MO3V3  TEST-POINT3X5  [PAD.03X.05]
TP23  S3MO5V  TEST-POINT3X5  [PAD.03X.05]
TP24  S4CK3V3  TEST-POINT3X5  [PAD.03X.05]
TP25  S4CK5V  TEST-POINT3X5  [PAD.03X.05]
TP26  S4MO3V3  TEST-POINT3X5  [PAD.03X.05]
TP27  S4MO5V  TEST-POINT3X5  [PAD.03X.05]
TP28  S5CK3V3  TEST-POINT3X5  [PAD.03X.05]
TP29  S5CK5V  TEST-POINT3X5  [PAD.03X.05]
TP30  S5MO3V3  TEST-POINT3X5  [PAD.03X.05]
TP31  S5MO5V  TEST-POINT3X5  [PAD.03X.05]
TP32  S1MISO  TEST-POINT3X5  [PAD.03X.05]
TP33  S1MOSI  TEST-POINT3X5  [PAD.03X.05]
TP34  S1CLK  TEST-POINT3X5  [PAD.03X.05]
TP35  GND  TEST-POINT3X5  [PAD.03X.05]
TP36  CSMAG  TEST-POINT3X5  [PAD.03X.05]
TP37  CSACC  TEST-POINT3X5  [PAD.03X.05]
TP38  CSGYRO  TEST-POINT3X5  [PAD.03X.05]
TP39  U2RX  TEST-POINT3X5  [PAD.03X.05]
TP40  U2TX  TEST-POINT3X5  [PAD.03X.05]
TP41  U2CTS  TEST-POINT3X5  [PAD.03X.05]
TP42  U1RX  TEST-POINT3X5  [PAD.03X.05]
TP43  U1TX  TEST-POINT3X5  [PAD.03X.05]
TP44  GND  TEST-POINT3X5  [PAD.03X.05]
TP45  U6RX  TEST-POINT3X5  [PAD.03X.05]
TP46  U6TX  TEST-POINT3X5  [PAD.03X.05]
TP47  I2C1DA  TEST-POINT3X5  [PAD.03X.05]
TP48  I2C1CL  TEST-POINT3X5  [PAD.03X.05]
TP49  BFR  TEST-POINT3X5  [PAD.03X.05]
TP50  BSBR  TEST-POINT3X5  [PAD.03X.05]
TP51  BSBM  TEST-POINT3X5  [PAD.03X.05]
TP52  BAD  TEST-POINT3X5  [PAD.03X.05]
TP53  GND  TEST-POINT3X5  [PAD.03X.05]
TP54  GND  TEST-POINT3X5  [PAD.03X.05]
TP55  SWCLK  TEST-POINT3X5  [PAD.03X.05]
TP56  SWDIO  TEST-POINT3X5  [PAD.03X.05]
TP57  RESETL  TEST-POINT3X5  [PAD.03X.05]
TP58  BOOT0  TEST-POINT3X5  [PAD.03X.05]
TP59  UD1L  TEST-POINT3X5  [PAD.03X.05]
TP60  UD2L  TEST-POINT3X5  [PAD.03X.05]
TP61  USBDP  TEST-POINT3X5  [PAD.03X.05]
TP62  USBDM  TEST-POINT3X5  [PAD.03X.05]
TP63  SDD0  TEST-POINT3X5  [PAD.03X.05]
TP64  SDD1  TEST-POINT3X5  [PAD.03X.05]
TP65  SDD2  TEST-POINT3X5  [PAD.03X.05]
TP66  SDD3  TEST-POINT3X5  [PAD.03X.05]
TP67  SDCK  TEST-POINT3X5  [PAD.03X.05]
TP68  SDCMD  TEST-POINT3X5  [PAD.03X.05]
TP70  CMPO  TEST-POINT3X5  [PAD.03X.05]
TP71  VRAW  TEST-POINT3X5  [PAD.03X.05]
TP72  L  TEST-POINT3X5  [PAD.03X.05]
TP73  HSCL  TEST-POINT3X5  [PAD.03X.05]
TP74  MSCL  TEST-POINT3X5  [PAD.03X.05]
TP75  J-  TEST-POINT3X5  [PAD.03X.05]
TP76  K  TEST-POINT3X5  [PAD.03X.05]
TP77  HSCH  TEST-POINT3X5  [PAD.03X.05]
TP78  GND  TEST-POINT3X5  [PAD.03X.05]
TP79  KTX  TEST-POINT3X5  [PAD.03X.05]
TP80  MSCH  TEST-POINT3X5  [PAD.03X.05]
TP81  J+  TEST-POINT3X5  [PAD.03X.05]
TP82  SWC  TEST-POINT3X5  [PAD.03X.05]
TP83  LTX  TEST-POINT3X5  [PAD.03X.05]
TP84  VBISO  TEST-POINT3X5  [PAD.03X.05]
TP85  ISORL  TEST-POINT3X5  [PAD.03X.05]
TP86  HSCT  TEST-POINT3X5  [PAD.03X.05]
TP87  HSCR  TEST-POINT3X5  [PAD.03X.05]
TP88  SWCT  TEST-POINT3X5  [PAD.03X.05]
TP89  SWCR  TEST-POINT3X5  [PAD.03X.05]
TP90  MSCT  TEST-POINT3X5  [PAD.03X.05]
TP91  MSCR  TEST-POINT3X5  [PAD.03X.05]
TP92  SWCM0  TEST-POINT3X5  [PAD.03X.05]
TP93  SWCM1  TEST-POINT3X5  [PAD.03X.05]
TP94  VBSW  TEST-POINT3X5  [PAD.03X.05]
TP95  5VSW  TEST-POINT3X5  [PAD.03X.05]
TP96  3V3SW  TEST-POINT3X5  [PAD.03X.05]
TP97  PSL  TEST-POINT3X5  [PAD.03X.05]
TP98  OSD  TEST-POINT3X5  [PAD.03X.05]
TP99  HAD  TEST-POINT3X5  [PAD.03X.05]
TP100  OAD  TEST-POINT3X5  [PAD.03X.05]
TP101  OAI  TEST-POINT3X5  [PAD.03X.05]
TP102  J-TL  TEST-POINT3X5  [PAD.03X.05]
TP103  J+T  TEST-POINT3X5  [PAD.03X.05]
TP104  VJ  TEST-POINT3X5  [PAD.03X.05]
TP105  VPWR  TEST-POINT3X5  [PAD.03X.05]
TP106  PWMR  TEST-POINT3X5  [PAD.03X.05]
TP107  J+VHL  TEST-POINT3X5  [PAD.03X.05]
TP108  DCDC5  TEST-POINT3X5  [PAD.03X.05]
TP109  USB5  TEST-POINT3X5  [PAD.03X.05]
TP110  GND  TEST-POINT3X5  [PAD.03X.05]
TP111  GND  TEST-POINT3X5  [PAD.03X.05]
TP112  GND  TEST-POINT3X5  [PAD.03X.05]
TP113  GND  TEST-POINT3X5  [PAD.03X.05]
U1  IC_VREF_3PIN-NCP51460SN33T1G  [SOT23-3]
U2  IC_OP-AMP_DUAL-OPA1662AIDR  [SOIC-8]
U3  DCDC_5V  REG-DCDC_5V  [CUI-5]
U6  3.3VREG_USB_POWER  REG-LINEAR_4-RT9080-33GJ5_INHIBIT_IS_ACTUALLY_ENABLE!  [SOT23-5]
U7  STN2120  IC_OBD_INTERPSTN2120  [QFN-44]
U9  IC_OBD_TXRX_CAN_MCP2551  [SOIC-8@1]
U10  IC_OBD_TXRX_CAN_MCP2551  [SOIC-8@1]
U11  IC_OBD_TXRX_SWCAN-TH8056A  [SOIC-8]
U12  IC_OP-AMP_DUAL-OPA1662AIDR  [SOIC-8]
U13  REG_LINEAR_3LM317LD  [SOIC-8]
U14  IC_OP-AMP_DUAL-OPA1662AIDR  [SOIC-8]
U15  ACC  SEN_ACC-LIS3DH  [LGA-16]
U16  GYRO  SEN_GYRO-FXAS21002C  [QFN-24]
U17  MAG  SEN_MAG-LIS3MDL  [VFLGA-12]
U18  Bluetooth UART  RN4X  [RN42]
U19  STM32F411  IC_MICRO_STM32F411-RXTX  [LQFP-64]
X1  XTAL-FA238  [FA-238]
X2  16MHz  XTAL-FA238  [FA-238]

## Nets
3.3V: C8.1 C20.2 C23.1 C24.1 C25.2 C26.2 C28.1 C29.1 C30.1 C31.2 C32.2 C33.2 C36.1 C38.1 C39.1 C40.1 C41.1 C42.1 C43.1 D2.+(A) D5.+(A) D6.+(A) D14.+(A) D15.+(A) D18.+(A) D19.+(A) D21.C J1.2 J2.2 J3.2 J5.1 J6.4 J8.2 M1.P$4(VDD) M7.P$3 M8.P$3 Q1.1(G) Q2.1(G) Q3.1(G) Q4.1(G) Q11.3(D) Q19.1(G) Q20.1(G) Q21.1(G) Q22.1(G) Q23.1(G) Q24.1(G) Q25.1(G) Q26.1(G) R1.2 R3.2 R5.2 R7.2 R13.2 R17.1 R23.2 R31.2 R40.2 R46.2 R50.2 R58.2 R59.2 R60.2 R61.2 R62.2 R63.1 R64.2 R73.1 R74.2 R76.2 R78.2 R80.2 R82.2 R84.2 R86.2 R88.2 R94.1 R97.2 R98.2 R99.1 R100.1 S2.P$3 S2.P$4 S3.P$3 S3.P$4 TP14.P$1 U6.5(VOUT) U7.P$28(28.VDD_0) U7.P$40(40.VDD_1) U15.P$1(1.VDD_IO) U15.P$14(14.VDD) U16.P$4(4.RST_B) U16.P$8(8.I2C_B/SPI) U16.P$15(15.VDD) U16.P$18(18.VDDIO) U17.P$5(VDD) U17.P$6(VDD_IO) U18.P$11(11.VDD) U19.P$13(VDDA/VREF+) U19.P$19(VDD) U19.P$32(VDD_1) U19.P$48(VDD_2) U19.P$64(VDD_3) ; supply symbol labelled SYM_3.3V
3V3_SW: Q11.2(S) TP96.P$1
5V: D3.C D7.C D16.+(A) Q10.3(D) R65.2 R75.2 R77.2 R79.2 R81.2 R83.2 R85.2 R87.2 R89.2 TP13.P$1 U6.1(VIN) U6.3(INHIBIT) ; supply symbol labelled SYM_5V
5V_SW: C14.1 C15.1 D13.A Q10.2(S) R48.2 R54.2 R56.2 R57.2 R66.2 R67.2 TP95.P$1 U9.3(VDD) U10.3(VDD)
5V_USB: D7.A F3.1 TP109.P$1
BLU_AUTO_DISC: J4.1 R73.2 TP52.P$1 U18.P$20(20.GPIO3)
BLU_CONN_STAT_LED: R68.1 U18.P$21(21.GPIO5)
BLU_FACT_RESET: J1.1 R70.2 TP49.P$1 U18.P$22(22.GPIO4)
BLU_SET_BR: J2.1 R71.2 TP50.P$1 U18.P$4(4.GPIO7)
BLU_SET_BT_MAST: J3.1 R72.2 TP51.P$1 U18.P$3(3.GPIO6)
BLU_SPI_CS: U18.P$23(23.SPI_CSB)
BLU_SPI_MISO: U18.P$24(24.SPI_MISO)
BLU_SPI_MOSI: U18.P$2(2.SPI_MOSI)
BLU_SPI_SCLK: U18.P$6(6.SPI_CLOCK)
BLU_TXRX_ACT_LED: R69.1 U18.P$31(31.GPIO8)
BOOT0: J8.1 R90.2 TP58.P$1 U19.P$60(BOOT0)
BRK_3V3: Q1.2(S) R1.1 TP5.P$1 U19.P$51(PC10)
BRK_12V: M11.P$1 Q1.3(D) R2.1 TP9.P$1
COMP_OUT: Q6.1(G) TP70.P$1 U2.1(OUTA)
DCDC5V: C4.PIN_2_+(+) C5.1 D3.A R9.2 TP108.P$1 U3.5(VOUT)
GND: C1.2 C2.2 C3.2 C4.PIN_1_-(-) C5.2 C6.2 C7.1 C8.2 C10.1 C11.1 C12.1 C13.1 C14.2 C15.2 C16.1 C17.2 C18.1 C19.1 C20.1 C21.1 C22.2 C23.2 C24.2 C25.1 C26.1 C27.1 C28.2 C29.2 C31.1 C32.1 C33.1 C34.1 C35.1 C36.2 C37.2 C38.2 C39.2 C40.2 C41.2 C42.2 C43.2 C44.2 C45.1 D1.A D4.-(C) D8.3(C) D9.3(C) D10.A D12.C D20.A J4.2 J5.3 J6.3 J7.P$1 M1.CD_SW1 M1.P$6(VSS1) M2.5(GND) M3.P$2 M4.P$2 M5.P$2 M6.P$2 M7.P$4 M8.P$4 M9.P$2 M10.4(4.GND_CHASSIS) M10.5(5.GND_SIGNAL) Q5.5(G) Q6.2(S) Q8.5(D) Q8.6(D) Q8.7(D) Q8.8(D) Q13.2(E) Q14.2(E) Q15.2(S) Q16.2(S) Q18.2(S) Q27.2(S) R10.1 R14.1 R16.1 R19.1 R25.1 R26.1 R38.1 R43.1 R49.1 R52.1 R70.1 R71.1 R72.1 R90.1 R93.2 R101.1 R102.1 R104.1 R105.1 S1.P$1 S1.P$2 S4.COM TP15.P$1 TP35.P$1 TP44.P$1 TP53.P$1 TP54.P$1 TP78.P$1 TP110.P$1 TP111.P$1 TP112.P$1 TP113.P$1 U1.3(GND) U2.4(V-) U3.7(GND) U3.9(GND) U6.2(GND) U7.P$1(1.GP28) U7.P$2(2.GP29) U7.P$3(3.GP30) U7.P$6(6.VSS) U7.P$15(15.GP31) U7.P$16(16.AVSS) U7.P$20(20.GP32) U7.P$26(26.GP33) U7.P$29(29.VSS_0) U7.P$37(37.GP34) U7.P$38(38.GP35) U7.P$39(39.VSS_1) U7.P$45(PAD) U9.2(VSS) U10.2(VSS) U11.8(GND) U12.4(V-) U14.4(V-) U15.P$5(5.GND) U15.P$10(10.RES) U15.P$12(12.GND) U15.P$13(13.ADC3) U15.P$15(15.ADC2) U15.P$16(16.ADC1) U16.P$1(1.GND1) U16.P$5(5.GND2) U16.P$6(6.RSVD_GND1) U16.P$7(7.RSVD_GND2) U16.P$9(9.RSVD_GND3) U16.P$10(10.RSVD_GND4) U16.P$14(14.GND3) U16.P$19(19.GND4) U16.P$20(20.RSVD_GND5) U16.P$21(21.RSVD_GND6) U16.P$22(22.RSVD_GND7) U16.P$23(23.RSVD_GND8) U16.P$24(24.RSVD_GND9) U17.P$2(RES) U17.P$3(GND) U17.P$12(RES_1) U18.P$1(1.GND) U18.P$12(12.GND1) U18.P$28(28.GND3) U18.P$29(29.GND2) U18.SHEILD1(SHIELD) U18.SHEILD2(SHIELD) U18.SHEILD3(SHIELD) U18.SHEILD4(SHIELD) U19.P$12(VSSA/VREF-) U19.P$18(VSS) U19.P$31(VSS_1) U19.P$47(VSS_2) U19.P$63(VSS_3) X1.P$2(COVER) X1.P$4(COVER) X2.P$2(COVER) X2.P$4(COVER) ; supply symbol labelled SYM_GND
HS_CAN_HI: D8.2(C1) M10.6(6.HS_CAN_HI) R27.2 TP77.P$1 U9.7(CANH)
HS_CAN_LO: D8.1(C2) M10.14(14.HS_CAN_LO) R28.2 TP73.P$1 U9.8(CANL)
HS_CAN_RX: R57.1 R61.1 TP87.P$1 U7.P$10(10.HS_CAN_RX/GP8) U9.4(ROUT)
HS_CAN_TX: R56.1 R59.1 TP86.P$1 U7.P$8(8.HS_CAN_TX/GP9) U9.1(TIN)
I2C1_SCL: M7.P$1 R100.2 TP48.P$1 U19.P$58(PB6)
I2C1_SDA: M7.P$2 R99.2 TP47.P$1 U19.P$59(PB7)
ISO_K_TX_L: R35.1 TP79.P$1 U7.P$43(43.ISO_K_TX_L/GP6)
ISO_L_TX_L: R36.1 TP83.P$1 U7.P$44(44.ISO_L_TX_L/GP7)
ISO_RX_L: R40.1 TP85.P$1 U7.P$21(21.ISO_RX_L/GP5) U12.1(OUTA)
J1850_BUS+: D11.C M10.2(2.J1850_PWM/VPW_POS) R44.1 R47.2 R53.1 TP81.P$1
J1850_BUS+_TX: Q16.1(G) R52.2 TP103.P$1 U7.P$24(24.J1850_BUS+_TX/GP2)
J1850_BUS+_VH_L: Q15.1(G) TP107.P$1 U7.P$25(25.J1850_BUS+_VH_L/GP4)
J1850_BUS-: M10.10(10.J1850_PWM_NEG) Q18.3(D) R45.1 R55.1 TP75.P$1
J1850_BUS-_TX_L: Q18.1(G) R54.1 TP102.P$1 U7.P$33(33.J1850_BUS-_TX_L/GP3)
K_LINE: M10.7(7.KLINE) Q13.3(C) R33.1 R39.1 TP76.P$1
L_LINE: M10.15(15.LLINE) Q14.3(C) R34.1 TP72.P$1
LTS_3V3: Q2.2(S) R3.1 TP4.P$1 U19.P$56(PB4)
LTS_12V: M11.P$2 Q2.3(D) R4.1 TP8.P$1
MS_CAN_HI: D9.2(C1) M10.3(3.MS_CAN_HI) R29.2 TP80.P$1 U10.7(CANH)
MS_CAN_LO: D9.1(C2) M10.11(11.MS_CAN_LO) R30.2 TP74.P$1 U10.8(CANL)
MS_CAN_RX: R62.1 TP91.P$1 U7.P$11(11.MS_CAN_RX/GP10) U10.4(ROUT)
MS_CAN_TX: R60.1 TP90.P$1 U7.P$9(9.MS_CAN_TX/GP11) U10.1(TIN)
N$1: M12.P$3 Q7.5(G) R91.1 S4.C2
N$2: C3.1 R9.1 R10.2 U3.6(VADJ)
N$3: Q6.3(D) R11.1 U3.10(ON/OFF_L)
N$4: M12.P$1 S4.C1
N$5: C6.1 R17.2 U7.P$17(17.AVDD)
N$6: J6.1 R12.2
N$7: D5.-(C) R21.2
N$8: D4.+(A) R20.1
N$9: D6.-(C) R22.2
N$10: C13.2 R28.1
N$11: C12.2 R27.1
N$12: R25.2 U10.6(RS)
N$13: C10.2 R29.1
N$14: R26.2 U9.6(RS)
N$15: F3.2 M2.1(VBUS)
N$16: Q8.1(S) Q8.2(S) Q8.3(S) Q9.1(G) Q10.1(G) Q11.1(G) R24.1
N$17: C11.2 R30.1
N$18: R37.1 R38.2 U12.3(+INA)
N$19: R32.1 U11.6(LOAD)
N$20: R39.2 U12.2(-INA)
N$21: Q13.1(B) R35.2
N$22: R44.2 U14.3(+INA)
N$23: Q14.1(B) R36.2
N$24: R45.2 U14.2(-INA)
N$25: Q15.3(D) R42.1 R43.2
N$26: R41.1 R42.2 U13.4(ADJ)
N$27: C19.2 U7.P$7(7.VCAP)
N$28: D10.C R47.1 U14.5(+INB)
N$29: D11.A Q17.1(D) Q17.2(D) Q17.3(D) Q17.4(D)
N$30: R48.1 R49.2 U14.6(-INB)
N$31: Q16.3(D) Q17.5(G) R51.1
N$32: D13.C R55.2
N$33: D12.A R53.2
N$34: C30.2 U17.P$4(C1)
N$35: D14.-(C) R68.2
N$36: D15.-(C) R69.2
N$37: C21.2 U7.P$30(30.OSC1) X1.P$1
N$38: C22.1 U7.P$31(31.OSC2) X1.P$3
N$39: C27.2 U16.P$16(16.VREGD)
N$40: C35.2 U19.P$6(PH1-OSC_OUT) X2.P$3
N$41: TP1.P$1 U18.P$19(19.GPIO2)
N$42: C34.2 U19.P$5(PH0-OSC_IN) X2.P$1
N$43: D2.-(C) R14.2
N$44: J6.2 R92.2
N$45: D18.-(C) R95.2
N$46: Q27.3(D) R103.P$1
N$47: D19.-(C) R96.2
N$48: Q5.6(S) Q5.7(S) Q5.8(S) Q7.6(S) Q7.7(S) Q7.8(S) R91.2
N$49: C45.2 M2.MOUNT5T(SHIELD) R93.1
N$50: D16.-(C) R105.2
N$69: C37.1 U19.P$30(VCAP_1)
OBD_ANALOG_IN: C7.2 D20.C D21.A R18.1 R19.2 TP101.P$1 U7.P$19(19.ANALOG_IN/GP17)
OBD_HOST_ACT_LED: R22.1 TP99.P$1 U7.P$13(13.LED_HOST_ACT_L/GP24)
OBD_OBD_ACT_LED: J7.P$2 R21.1 R63.2 TP100.P$1 U7.P$12(12.LED_OBD_ACT_L/RST_NVM_L/GP22)
OBD_STATUS_LED: R20.2 TP98.P$1 U7.P$14(14.LED_STATUS/GP26)
PWM_RX: R46.1 TP106.P$1 U7.P$23(23.PWM_RX/GP0) U14.1(OUTA)
PWR_SAVE_L: Q8.4(G) Q12.5(G) R23.1 TP97.P$1 U7.P$32(32.PWR_CTRL/GP19)
RESET_L: C44.1 R13.1 S1.P$3 S1.P$4 TP57.P$1 U7.P$18(18.RESET_L) U18.P$5(5.RESET) U19.P$7(NRST)
REV_3V3: Q4.2(S) R7.1 TP2.P$1 U19.P$62(PB9)
REV_12V: M11.P$4 Q4.3(D) R8.1 TP6.P$1
RTS_3V3: Q3.2(S) R5.1 TP3.P$1 U19.P$57(PB5)
RTS_12V: M11.P$3 Q3.3(D) R6.1 TP7.P$1
SD_CD_L: M1.CD_SW2 R94.2 U19.P$10(PC2)
SDIO_CK: M1.P$5(CLK) TP67.P$1 U19.P$36(PB15)
SDIO_CMD: M1.P$3(CMD) TP68.P$1 U19.P$54(PD2)
SDIO_D0: M1.P$7(DAT0) TP63.P$1 U19.P$39(PC8)
SDIO_D1: M1.P$8(DAT1) TP64.P$1 U19.P$40(PC9)
SDIO_D2: M1.P$1(DAT2) TP65.P$1 U19.P$42(PA9)
SDIO_D3: M1.P$2(CD/DAT3) TP66.P$1 U19.P$52(PC11)
SLEEP_L: R64.1 U7.P$27(27.SLEEP_L/GP18)
SPI1_CS_ACC: TP37.P$1 U15.P$8(8.CS) U19.P$35(PB14)
SPI1_CS_GYRO: TP38.P$1 U16.P$17(17.SPI_CS_B) U19.P$27(PB1)
SPI1_CS_MAG: J5.2 TP36.P$1 U17.P$10(CS) U19.P$28(PB2)
SPI1_MISO: TP32.P$1 U15.P$7(7.SDO/SA0) U16.P$13(13.SA0/MISO) U17.P$9(SD0/SA1) U19.P$22(PA6)
SPI1_MOSI: TP33.P$1 U15.P$6(6.SDA/SDI/SDO) U16.P$12(12.SDA/MOSI/SPI_DATA) U17.P$11(SDA/SDI/SDO) U19.P$23(PA7)
SPI1_SCK: TP34.P$1 U15.P$4(4.SCL/SPC) U16.P$11(11.SCL/SCLK) U17.P$1(SCL/SPC) U19.P$21(PA5)
SPI2_MOSI_3V3: Q20.2(S) R76.1 TP18.P$1 U19.P$11(PC3)
SPI2_MOSI_5V: M3.P$1 Q20.3(D) R77.1 TP19.P$1
SPI2_SCK_3V3: Q19.2(S) R74.1 TP16.P$1 U19.P$29(PB10)
SPI2_SCK_5V: M3.P$3 Q19.3(D) R75.1 TP17.P$1
SPI3_MOSI_3V3: Q22.2(S) R80.1 TP22.P$1 U19.P$53(PC12)
SPI3_MOSI_5V: M4.P$1 Q22.3(D) R81.1 TP23.P$1
SPI3_SCK_3V3: Q21.2(S) R78.1 TP20.P$1 U19.P$33(PB12)
SPI3_SCK_5V: M4.P$3 Q21.3(D) R79.1 TP21.P$1
SPI4_MOSI_3V3: Q24.2(S) R84.1 TP26.P$1 U19.P$15(PA1)
SPI4_MOSI_5V: M5.P$1 Q24.3(D) R85.1 TP27.P$1
SPI4_SCK_3V3: Q23.2(S) R82.1 TP24.P$1 U19.P$34(PB13)
SPI4_SCK_5V: M5.P$3 Q23.3(D) R83.1 TP25.P$1
SPI5_MOSI_3V3: Q26.2(S) R88.1 TP30.P$1 U19.P$61(PB8)
SPI5_MOSI_5V: M6.P$1 Q26.3(D) R89.1 TP31.P$1
SPI5_SCK_3V3: Q25.2(S) R86.1 TP28.P$1 U19.P$26(PB0)
SPI5_SCK_5V: M6.P$3 Q25.3(D) R87.1 TP29.P$1
SW_CAN: C16.2 M10.1(1.SWCAN) R32.2 R103.P$2 TP82.P$1 U11.7(CANH)
SW_CAN_LOAD: Q27.1(G) R104.2 U7.P$34(34.SW_CAN_LOAD/GP16)
SW_CAN_MODE0: R67.1 TP92.P$1 U7.P$35(35.SW_CAN_MODE0/GP14) U11.2(MODE0)
SW_CAN_MODE1: R66.1 TP93.P$1 U7.P$36(36.SW_CAN_MODE1/GP15) U11.3(MODE1)
SW_CAN_RX: R31.1 TP89.P$1 U7.P$42(42.SW_CAN_RX/GP12) U11.4(ROUT)
SW_CAN_TX: R65.1 TP88.P$1 U7.P$41(41.SW_CAN_TX/GP13) U11.1(TIN)
SWCLK: R12.1 R97.1 TP55.P$1 U19.P$49(PA14)
SWDIO: R92.1 R98.1 TP56.P$1 U19.P$46(PA13)
US1: R102.2 S3.P$1 S3.P$2 U19.P$20(PA4)
US2: R101.2 S2.P$1 S2.P$2 U19.P$24(PC4)
USART1_RX: R58.1 TP42.P$1 U7.P$4(4.UART_TX) U19.P$55(PB3)
USART1_TX: TP43.P$1 U7.P$5(5.UART_RX) U19.P$50(PA15)
USART2_CTS: TP41.P$1 U18.P$15(15.UART_RTS) U19.P$14(PA0)
USART2_RX: TP39.P$1 U18.P$13(13.UART_RX) U19.P$17(PA3)
USART2_TX: TP40.P$1 U18.P$14(14.UART_TX) U19.P$16(PA2)
USART6_RX: M8.P$1 TP45.P$1 U19.P$38(PC7)
USART6_TX: M8.P$2 TP46.P$1 U19.P$37(PC6)
USB_OTG_FS_DM: M2.2(D-) TP62.P$1 U19.P$44(PA11)
USB_OTG_FS_DP: M2.3(D+) TP61.P$1 U19.P$45(PA12)
USER_LED1L: R95.1 TP59.P$1 U19.P$8(PC0)
USER_LED2L: R96.1 TP60.P$1 U19.P$9(PC1)
V_BACKUP: U19.P$1(VBAT)
V_BATT: C2.1 C17.1 D1.C F2.2 Q9.3(D) Q12.6(S) Q12.7(S) Q12.8(S) R2.2 R4.2 R6.2 R8.2 R11.2 R15.2 R18.2 R24.2 TP12.P$1 U1.1(VIN) U2.8(V+) U3.1(VIN) U11.5(VBAT) U12.8(V+) ; supply symbol labelled SYM_V_BATT
V_BATT_ISO: Q12.1(D) Q12.2(D) Q12.3(D) Q12.4(D) R33.2 R34.2 TP84.P$1
V_BATT_RAW: M9.P$3 M10.16(16.+12V_ALWAYS_ON) Q5.1(D) Q5.2(D) Q5.3(D) Q5.4(D) TP10.P$1 TP71.P$1
V_BATT_REVP: C1.1 F2.1 Q7.1(D) Q7.2(D) Q7.3(D) Q7.4(D) TP11.P$1
V_BATT_SW: C18.2 Q9.2(S) R37.2 TP94.P$1 U13.1(VIN) U14.8(V+)
V_COMP_+: U1.2(VOUT) U2.3(+INA)
V_COMP_-: R15.1 R16.2 U2.2(-INA)
V_J1850: Q17.6(S) Q17.7(S) Q17.8(S) R41.2 R51.2 TP104.P$1 U13.2(VOUT) U13.3(VOUT) U13.6(VOUT) U13.7(VOUT)
VPW_RX: R50.1 TP105.P$1 U7.P$22(22.VPW_RX/GP1) U14.7(OUTB)
Unconnected: M2.4(ID) M12.P$2 U2.5(+INB) U2.6(-INB) U2.7(OUTB) U9.5(VREF) U10.5(VREF) U12.5(+INB) U12.6(-INB) U12.7(OUTB) U15.P$9(9.INT2) U15.P$11(11.INT1) U16.P$2(2.INT_2/PWR_CTRL) U16.P$3(3.INT1) U17.P$7(INT) U17.P$8(DRDY) U18.P$7(7.PCM_CLK) U18.P$8(8.PCM_SYNC) U18.P$9(9.PCM_IN) U18.P$10(10.PCM_OUT) U18.P$16(16.UART_CTS) U18.P$17(17.USB_D+) U18.P$18(18.USB_D-) U18.P$30(30.AIO0) U18.P$32(32.GPIO9) U18.P$33(33.GPIO10) U18.P$34(34.GPIO11) U18.P$35(35.AIO1) U19.P$2(PC13) U19.P$3(PC14-OSC32_IN) U19.P$4(PC15-OSC32_OUT) U19.P$25(PC5) U19.P$41(PA8) U19.P$43(PA10)

## Notes on the sheet
- Regulator and VBATT Comparator
- Power Indicator LEDS
- Micro + Related
- Seeed GROVE I2C EXP
- SWD
- RESET + PULLUP
- BOOT0 Jumper | BOOT1 Jumper
- Seeed GROVE USART EXP
- VBATT + Capacitance
- USER LEDS
- ISO Transceiver
- How TF does this work? Seems like the gate will always 
  be too low to turn the switch off...
- SD
- User Buttons
- HS / MS CAN Transceiver | External Sensors
- Signal Input Protection | LED Output Conditioning
- Optional ESD Pro.
- J1850 Transceiver
- Power Saving Switches
- Optional ESD Pro.
- OBD-II Connector
- SW CAN Transceiver
- Battery Sense Circuit | Status LEDs
- Bluetooth UART Module
- STN2120
- Test Points
- LED Output Lines | SD, USB, SWD, LEDS, RESET | Sensor SPI Lines | General Serial Interfaces
- Note: RESET_L already has a 10k pulllup
   to 3V3 in the power supply block
- OBD Test Points
- Bluetooth Options | Power | Input Signals
- RAW OBD Inputs | ISO Transceiver | CAN
- SWCAN
- J1850 Transceiver
- Switched Supplies
- Status + Pwr Save

## Library data of the parts
C1-C3 C5-C8 C10-C45 = AES:PASS_CAP_CER
C4 = AES:PASS_CAP_TANT
D1 = AES:PASS_DIODE_ZENER
D2 D4 D14 D16 D18 D19 = AES:PASS_DIODE_LED; COLOR: Blue; IF: 5 mA; M: 40 mcd; VF: 2.9 V
D3 D7 = AES:PASS_DIODE_SCHOTTKY
D5 D6 D15 = AES:PASS_DIODE_LED; COLOR: Orange
D8 D9 = AES:PASS_DIODE_ESD_CAN
D10-D13 D20 D21 = AES:PASS_DIODE_GEN
F2 F3 = AES:PASS_FUSE_POLY
J1-J4 J7 J8 = AES:ZMISC_JUMPER_2
J5 = AES:ZMISC_JUMPER_3
J6 = AES:ZMISC_JUMPER_4
M1 = AES:SD_MICRO_SOCKET
M2 = AES:USB_MICRO
M3-M6 M12 = AES:CONN_LED_OUT
M7 M8 M11 = AES:CONN_LOCK_4
M9 = AES:CONN_LOCK_2
M10 = AES:OBD_CONN
Q1-Q4 Q9-Q11 = AES:PASS_NMOS
Q5 Q7 Q12 Q17 = AES:AMP_MOSFET_PCH
Q6 Q15 Q16 Q18-Q27 = AES:AMP_MOSFET_NCH
Q8 = AES:PASS_PMOS
Q13 Q14 = AES:AMP_BJT_NPN
R1-R105 = AES:PASS_RES
S1-S3 = AES:BUTTON_TEMP_ON
S4 = AES:SWITCH_SPDT_SLIDE
TP1-TP68 TP70-TP113 = AES:TEST-POINT: SparkFun Test Points Bare copper test points for troubleshooting or In-Circuit-Testing. These are used by our Production team for verifying production board runs using pogo-pins on test beds. SparkFun Products: SparkFun LSM9DS1 Breakout <https://www.sparkfun.com/products/13284> SparkFun PSOC <https://www.sparkfun.com/products/13714> SparkFun Load Cell Amplifier <https://www.sparkfun.com/products/13879>
U1 = AES:IC_VREF_3PIN
U2 U12 U14 = AES:IC_OP-AMP_DUAL
U3 = AES:REG-DCDC_5V
U6 = AES:REG-LINEAR_4
U7 = AES:IC_OBD_INTERP
U9 U10 = AES:IC_OBD_TXRX_CAN_MCP2551
U11 = AES:IC_OBD_TXRX_SWCAN
U13 = AES:REG_LINEAR_3
U15 = AES:SEN_ACC
U16 = AES:SEN_GYRO
U17 = AES:SEN_MAG
U18 = AES:RN4X
U19 = AES:IC_MICRO_STM32F411
X1 X2 = AES:XTAL